# EAGLE design 1013-B-solarwhat-power (EAGLE 7.5.0)

## Sheet 1 of 6
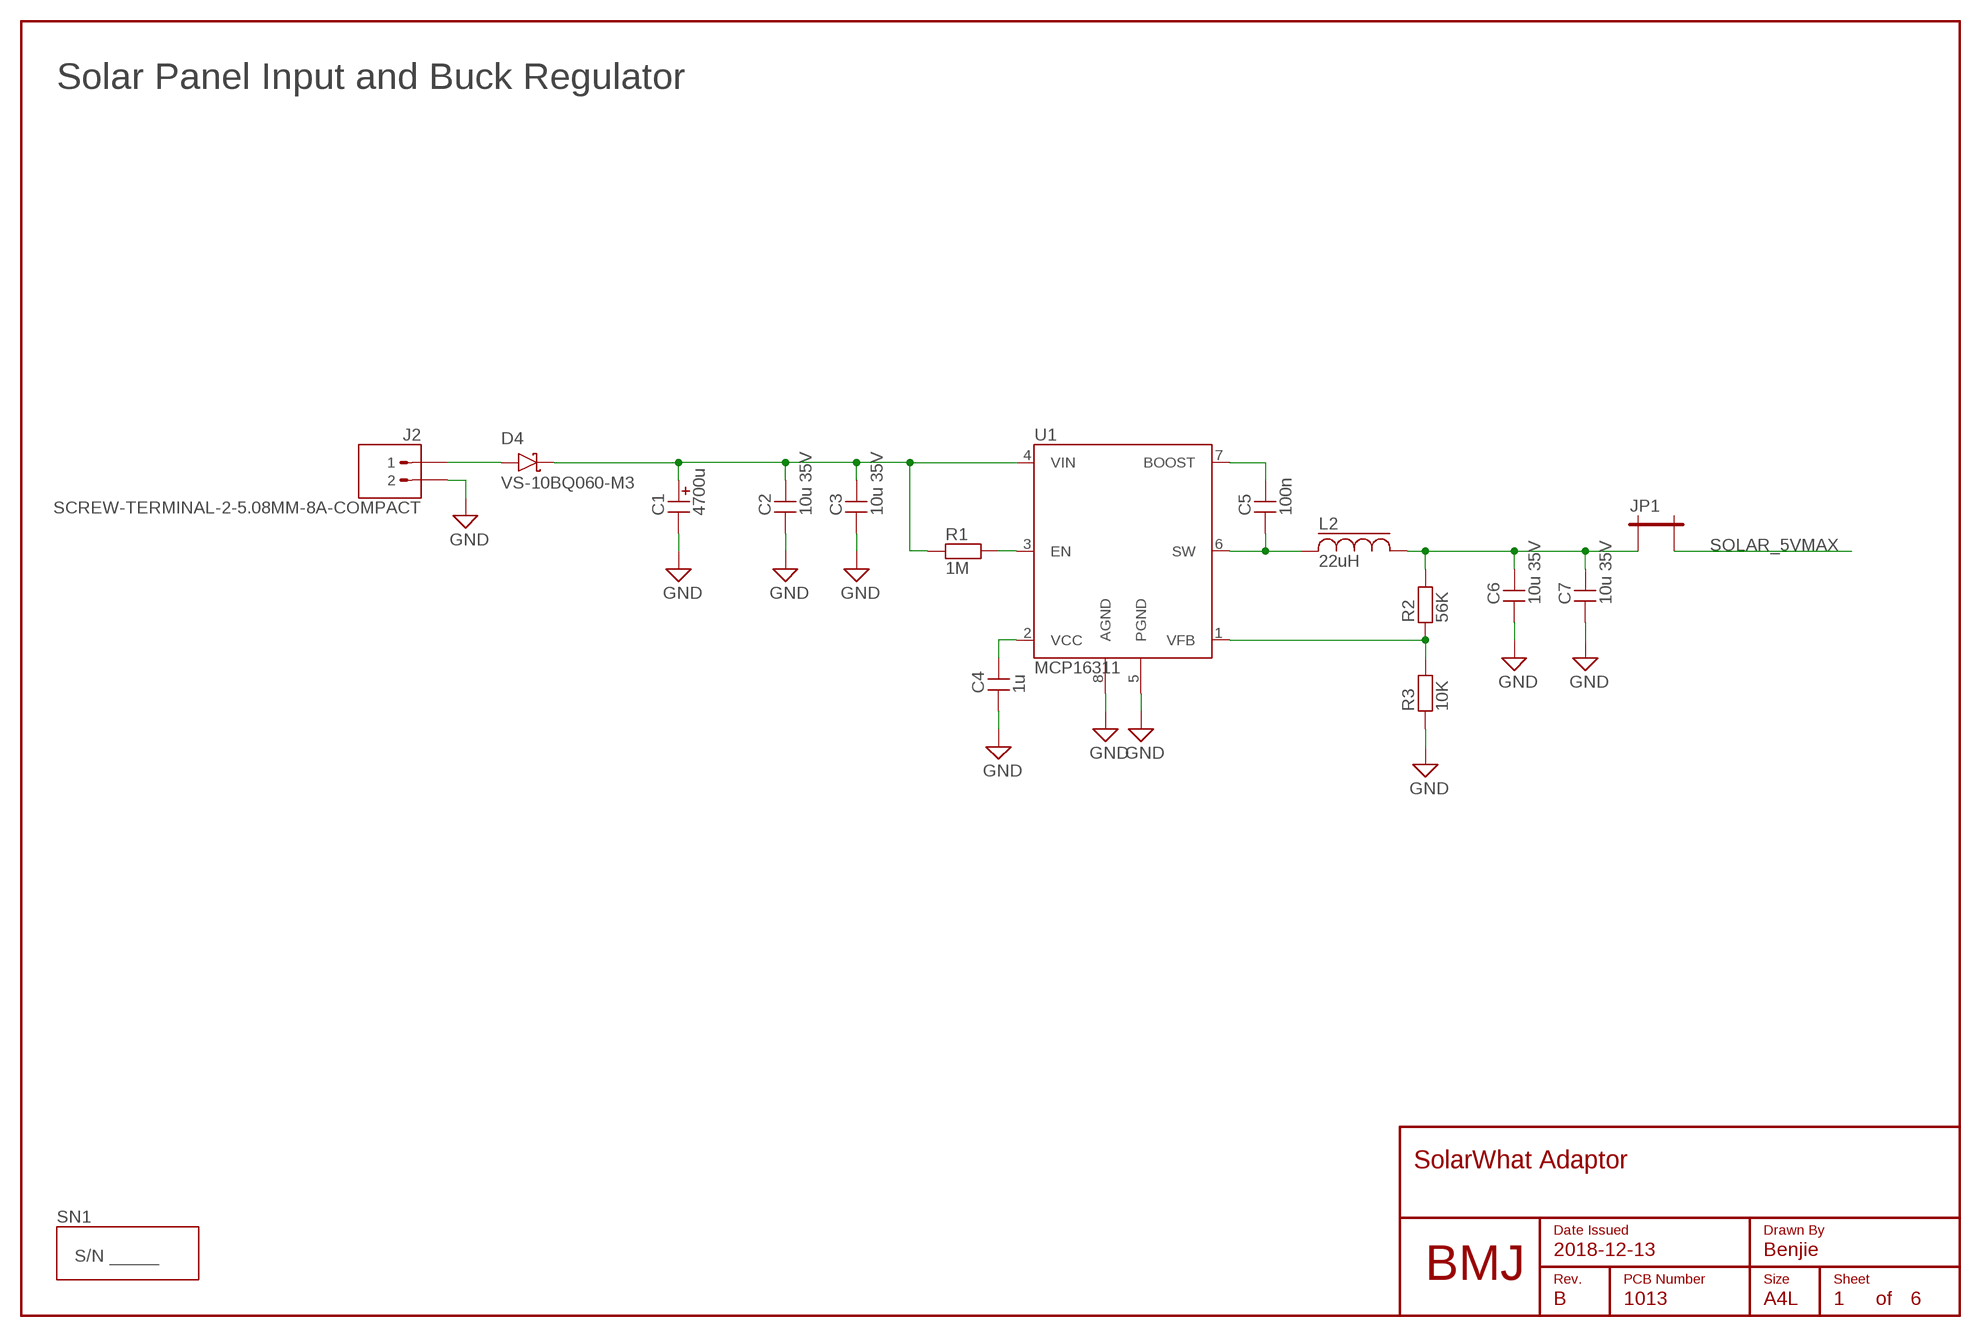
[diagram p0: schematic, sheet 1]

### Parts
C1  4700u  BIG-ELECTROLYTIC  [18X36-TH-FLAT]
C2  10u 35V  1206-10U-35V  [1206]
C3  10u 35V  1206-10U-35V  [1206]
C4  1u  0805-1U  [0805]
C5  100n  0603-100N  [0603]
C6  10u 35V  1206-10U-35V  [1206]
C7  10u 35V  1206-10U-35V  [1206]
D4  VS-10BQ060-M3  [SMB-ST]
FRAME1  A4L-NEW  [PCB-ID]
J2  SCREW-TERMINAL-2-5.08MM-8A-COMPACT  [CTBP0508/2]
JP1  SOLDER-JUMPER-2MM  [SOLDER-JUMPER-2MM]
L2  22uH  TDK-VLSX6045EX-220M  [TDK-VLSX6045EX]
LOGO1  BMJ-LOGO  [BMJ-LOGO]
R1  1M  0603-1%-1M  [0603]
R2  56K  0603-1%-56K  [0603]
R3  10K  0603-1%-10K  [0603]
SN1  SERIAL-NUMBER-AREA  [SERIAL-NUMBER-AREA-SMALL]
U1  MCP16311  [MSOP-8]

### Nets
GND: C1.- C2.1 C3.1 C4.1 C6.1 C7.1 J2.2 R3.1 U1.5(PGND) U1.8(AGND) ; also sheet 2,4,5
N$1: R1.2 U1.3(EN)
N$2: C1.+ C2.2 C3.2 D4.K(C) R1.1 U1.4(VIN)
N$3: C4.2 U1.2(VCC)
N$4: C5.2 U1.7(BOOST)
N$5: C5.1 L2.1 U1.6(SW)
N$6: D4.A J2.1
N$7: R2.1 R3.2 U1.1(VFB)
N$56: C6.2 C7.2 JP1.1 L2.2 R2.2
SOLAR_5VMAX: JP1.2 ; also sheet 2,3

### Notes on the sheet
- Solar Panel Input and Buck Regulator

## Sheet 2 of 6
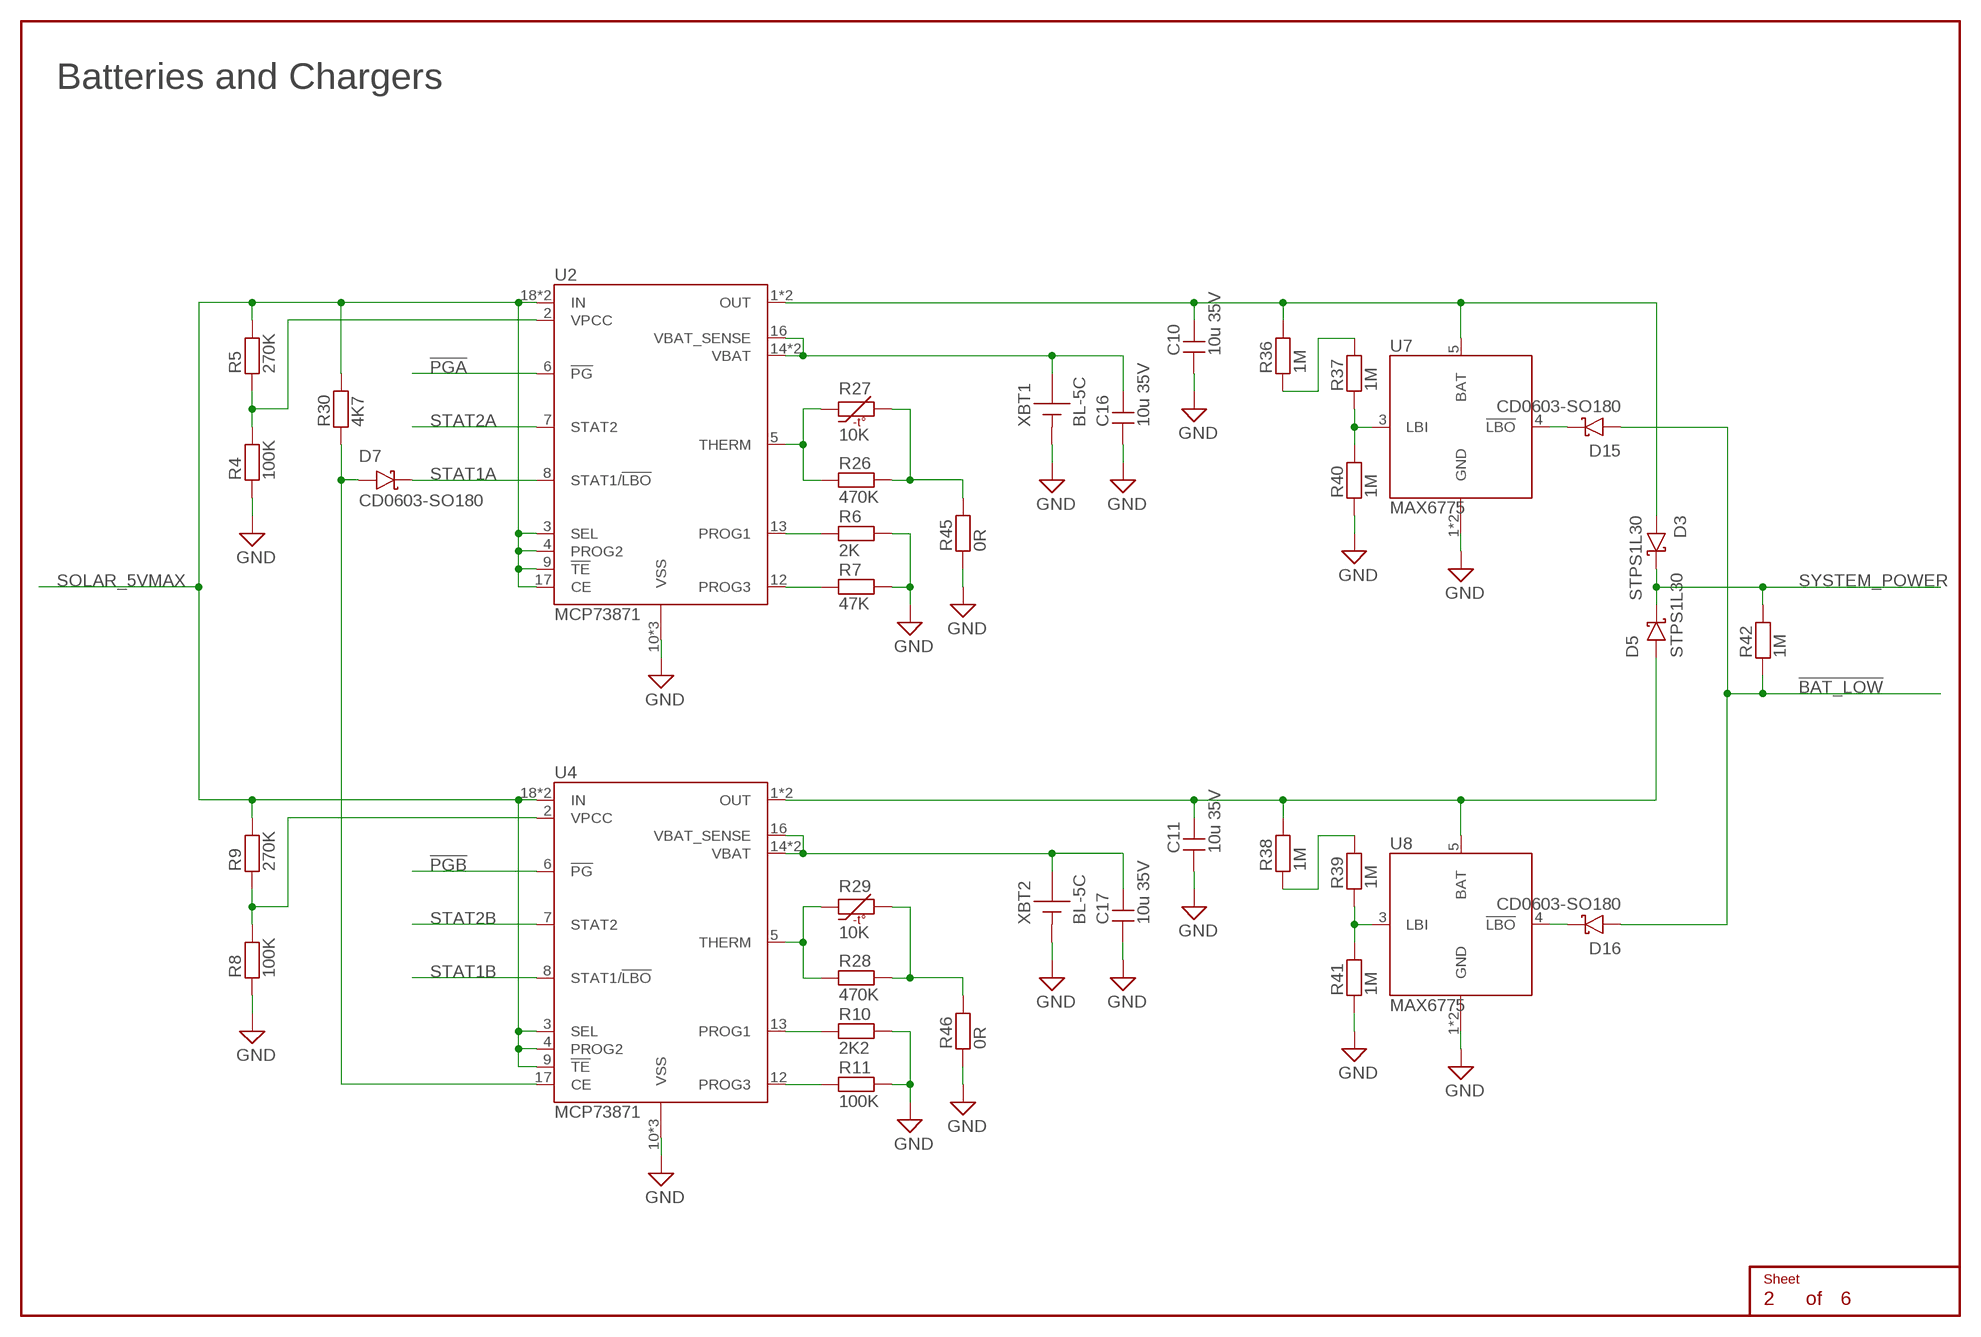
[diagram p1: schematic, sheet 2]

### Parts
C10  10u 35V  1206-10U-35V  [1206]
C11  10u 35V  1206-10U-35V  [1206]
C16  10u 35V  1206-10U-35V  [1206]
C17  10u 35V  1206-10U-35V  [1206]
D3  STPS1L30  [SMB-ST]
D5  STPS1L30  [SMB-ST]
D7  CD0603-SO180  [0603]
D15  CD0603-SO180  [0603]
D16  CD0603-SO180  [0603]
FRAME2  A4L-CONTINUATION  [EMPTY]
R4  100K  0603-1%-100K  [0603]
R5  270K  0603-1%-270K  [0603]
R6  2K  0603-1%-2K  [0603]
R7  47K  0603-1%-47K  [0603]
R8  100K  0603-1%-100K  [0603]
R9  270K  0603-1%-270K  [0603]
R10  2K2  0603-1%-2K2  [0603]
R11  100K  0603-1%-100K  [0603]
R26  470K  0603-1%-470K  [0603]
R27  10K  NTC-0603-10K  [0603]
R28  470K  0603-1%-470K  [0603]
R29  10K  NTC-0603-10K  [0603]
R30  4K7  0603-1%-4K7  [0603]
R36  1M  0603-1%-1M  [0603]
R37  1M  0603-1%-1M  [0603]
R38  1M  0603-1%-1M  [0603]
R39  1M  0603-1%-1M  [0603]
R40  1M  0603-1%-1M  [0603]
R41  1M  0603-1%-1M  [0603]
R42  1M  0603-1%-1M  [0603]
R45  0R  0603-1%-0R  [0603]
R46  0R  0603-1%-0R  [0603]
U2  MCP73871  [QFN-20]
U4  MCP73871  [QFN-20]
U7  MAX6775  [SC70]
U8  MAX6775  [SC70]
XBT1  BL-5C  BL-5CBL5C  [3MM-BATTERY-3WAY]
XBT2  BL-5C  BL-5CBL5C  [3MM-BATTERY-3WAY]

### Nets
!BAT_LOW: D15.A D16.A R42.1 ; also sheet 4,5
!PGA: U2.6(!PG) ; also sheet 3
!PGB: U4.6(!PG) ; also sheet 3
GND: C10.1 C11.1 C16.1 C17.1 R4.1 R6.2 R7.2 R8.1 R10.2 R11.2 R40.1 R41.1 R45.1 R46.1 U2.10(VSS) U2.11(VSS) U2.PAD(VSS) U4.10(VSS) U4.11(VSS) U4.PAD(VSS) U7.1(GND) U7.2(GND) U8.1(GND) U8.2(GND) XBT1.- XBT2.- ; also sheet 1,4,5
N$9: R4.2 R5.1 U2.2(VPCC)
N$10: R6.1 U2.13(PROG1)
N$11: R7.1 U2.12(PROG3)
N$12: C16.2 U2.14(VBAT) U2.15(VBAT) U2.16(VBAT_SENSE) XBT1.+
N$13: C10.2 D3.A R36.2 U2.1(OUT) U2.20(OUT) U7.5(BAT)
N$15: R8.2 R9.1 U4.2(VPCC)
N$16: R10.1 U4.13(PROG1)
N$17: R11.1 U4.12(PROG3)
N$18: C17.2 U4.14(VBAT) U4.15(VBAT) U4.16(VBAT_SENSE) XBT2.+
N$19: C11.2 D5.A R38.2 U4.1(OUT) U4.20(OUT) U8.5(BAT)
N$33: D7.A R30.1 U4.17(CE)
N$37: R26.1 R27.1 U2.5(THERM)
N$39: R28.1 R29.1 U4.5(THERM)
N$46: R36.1 R37.2
N$48: R37.1 R40.2 U7.3(LBI)
N$50: R38.1 R39.2
N$51: R39.1 R41.2 U8.3(LBI)
N$52: D15.K(C) U7.4(!LBO)
N$54: D16.K(C) U8.4(!LBO)
N$55: R26.2 R27.2 R45.2
N$57: R28.2 R29.2 R46.2
SOLAR_5VMAX: R5.2 R9.2 R30.2 U2.3(SEL) U2.4(PROG2) U2.9(!TE) U2.17(CE) U2.18(IN) U2.19(IN) U4.3(SEL) U4.4(PROG2) U4.9(!TE) U4.18(IN) U4.19(IN) ; also sheet 1,3
STAT1A: D7.K(C) U2.8(STAT1/!LBO) ; also sheet 3
STAT1B: U4.8(STAT1/!LBO) ; also sheet 3
STAT2A: U2.7(STAT2) ; also sheet 3
STAT2B: U4.7(STAT2) ; also sheet 3
SYSTEM_POWER: D3.K(C) D5.K(C) R42.2 ; also sheet 4,5

### Notes on the sheet
- Batteries and Chargers

## Sheet 3 of 6
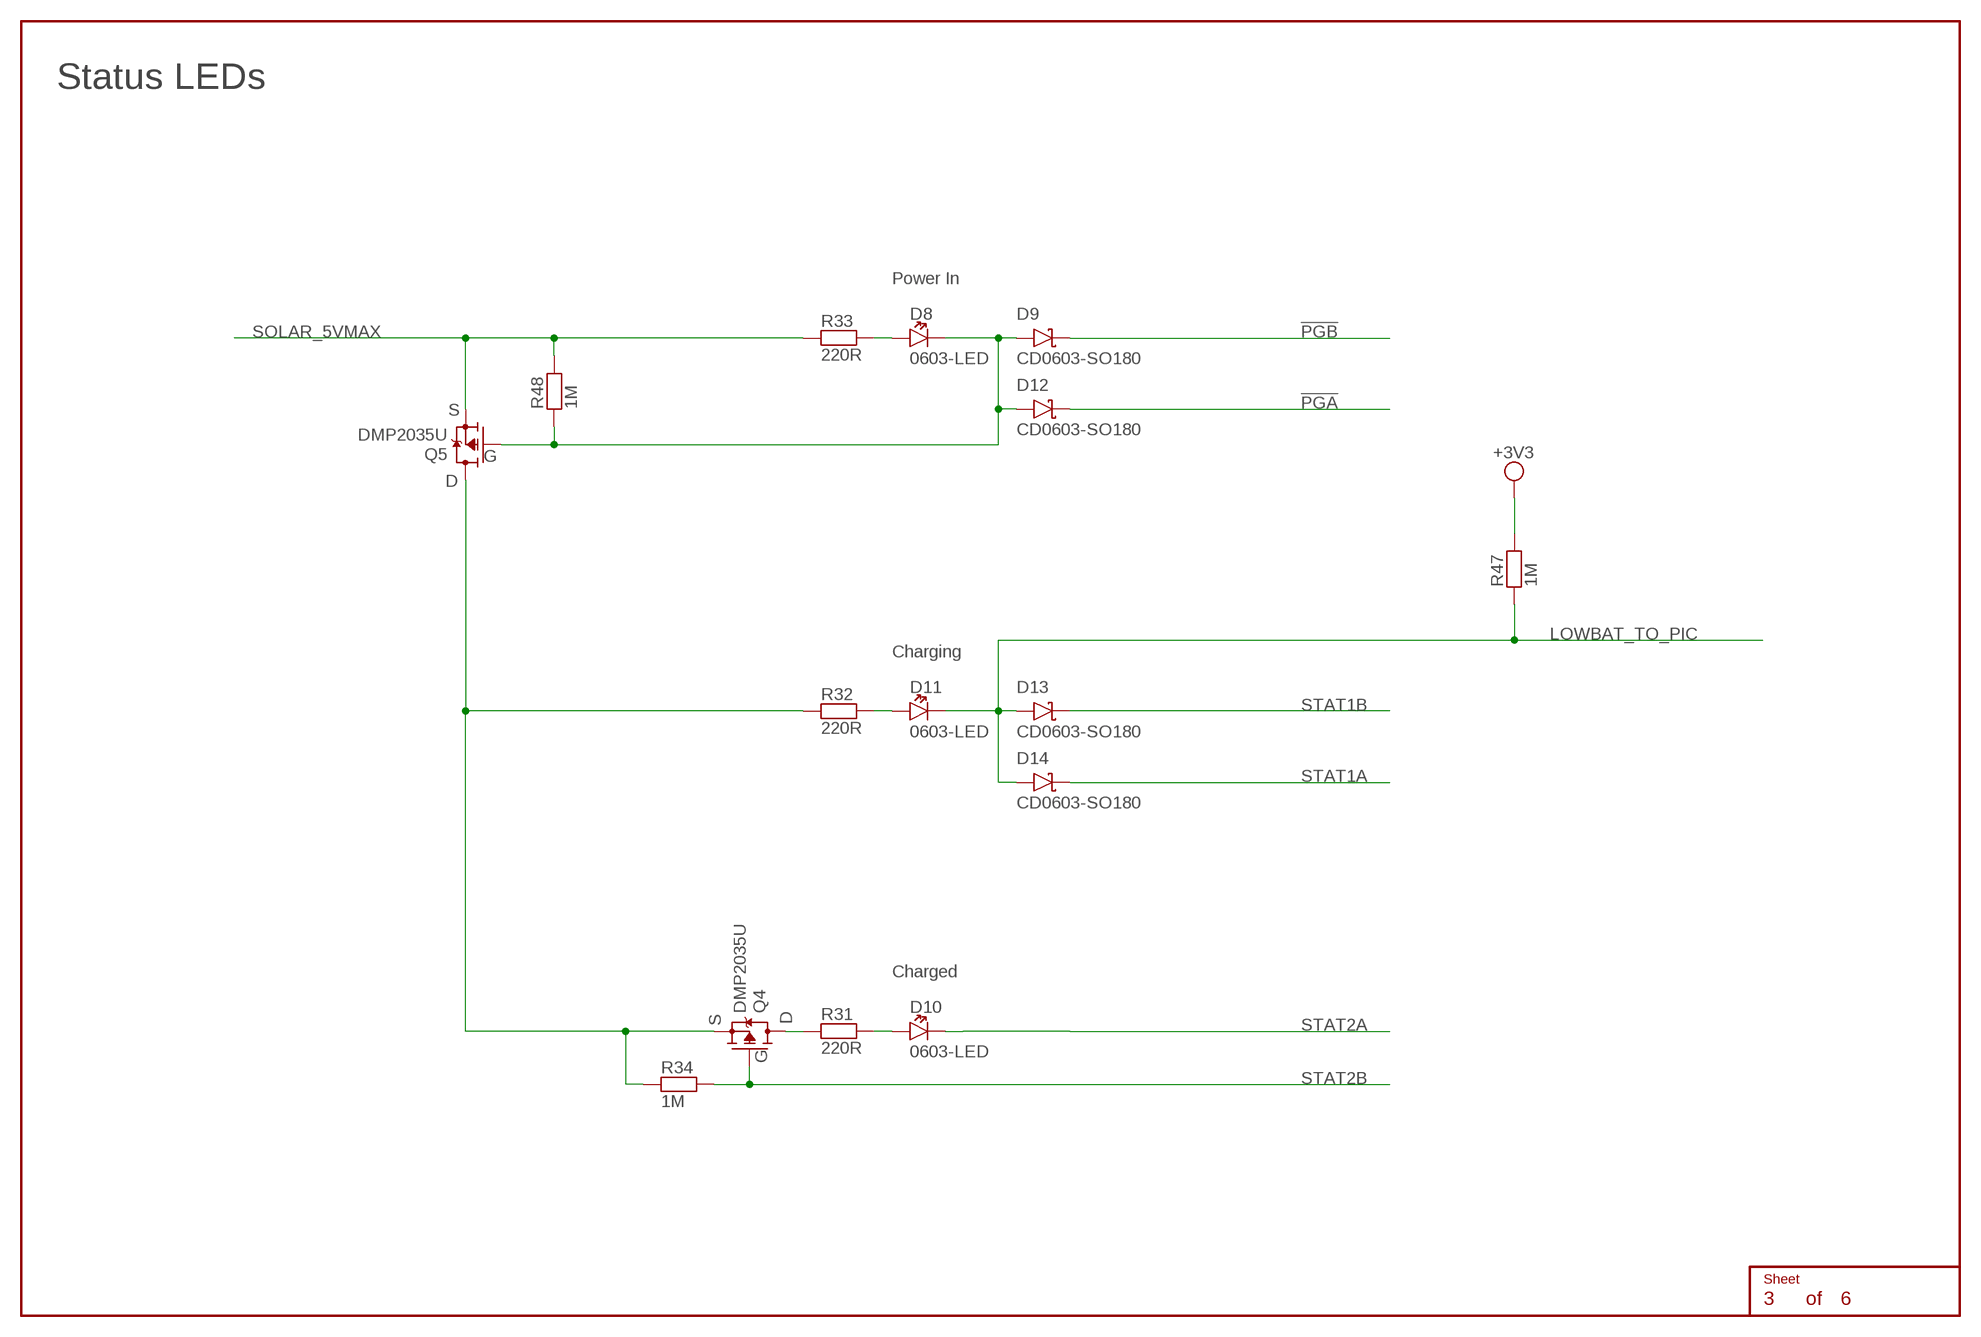
[diagram p2: schematic, sheet 3]

### Parts
D8  0603-LED  [0603-LED]
D9  CD0603-SO180  [0603]
D10  0603-LED  [0603-LED]
D11  0603-LED  [0603-LED]
D12  CD0603-SO180  [0603]
D13  CD0603-SO180  [0603]
D14  CD0603-SO180  [0603]
FRAME5  A4L-CONTINUATION  [EMPTY]
Q4  DMP2035U  [SOT-23]
Q5  DMP2035U  [SOT-23]
R31  220R  0603-1%-220R  [0603]
R32  220R  0603-1%-220R  [0603]
R33  220R  0603-1%-220R  [0603]
R34  1M  0603-1%-1M  [0603]
R47  1M  0603-1%-1M  [0603]
R48  1M  0603-1%-1M  [0603]

### Nets
!PGA: D12.K(C) ; also sheet 2
!PGB: D9.K(C) ; also sheet 2
+3V3: R47.2 ; also sheet 5
GATED-LED-POWER: Q4.2(S) Q5.3(D) R32.1 R34.1
LOWBAT_TO_PIC: D11.C D13.A D14.A R47.1 ; also sheet 5
N$40: D8.C D9.A D12.A Q5.1(G) R48.1
N$41: Q4.3(D) R31.1
N$44: D10.A R31.2
N$47: D11.A R32.2
N$49: D8.A R33.2
SOLAR_5VMAX: Q5.2(S) R33.1 R48.2 ; also sheet 1,2
STAT1A: D14.K(C) ; also sheet 2
STAT1B: D13.K(C) ; also sheet 2
STAT2A: D10.C ; also sheet 2
STAT2B: Q4.1(G) R34.2 ; also sheet 2

### Notes on the sheet
- Status LEDs
- Power In
- Charging
- Charged

## Sheet 4 of 6
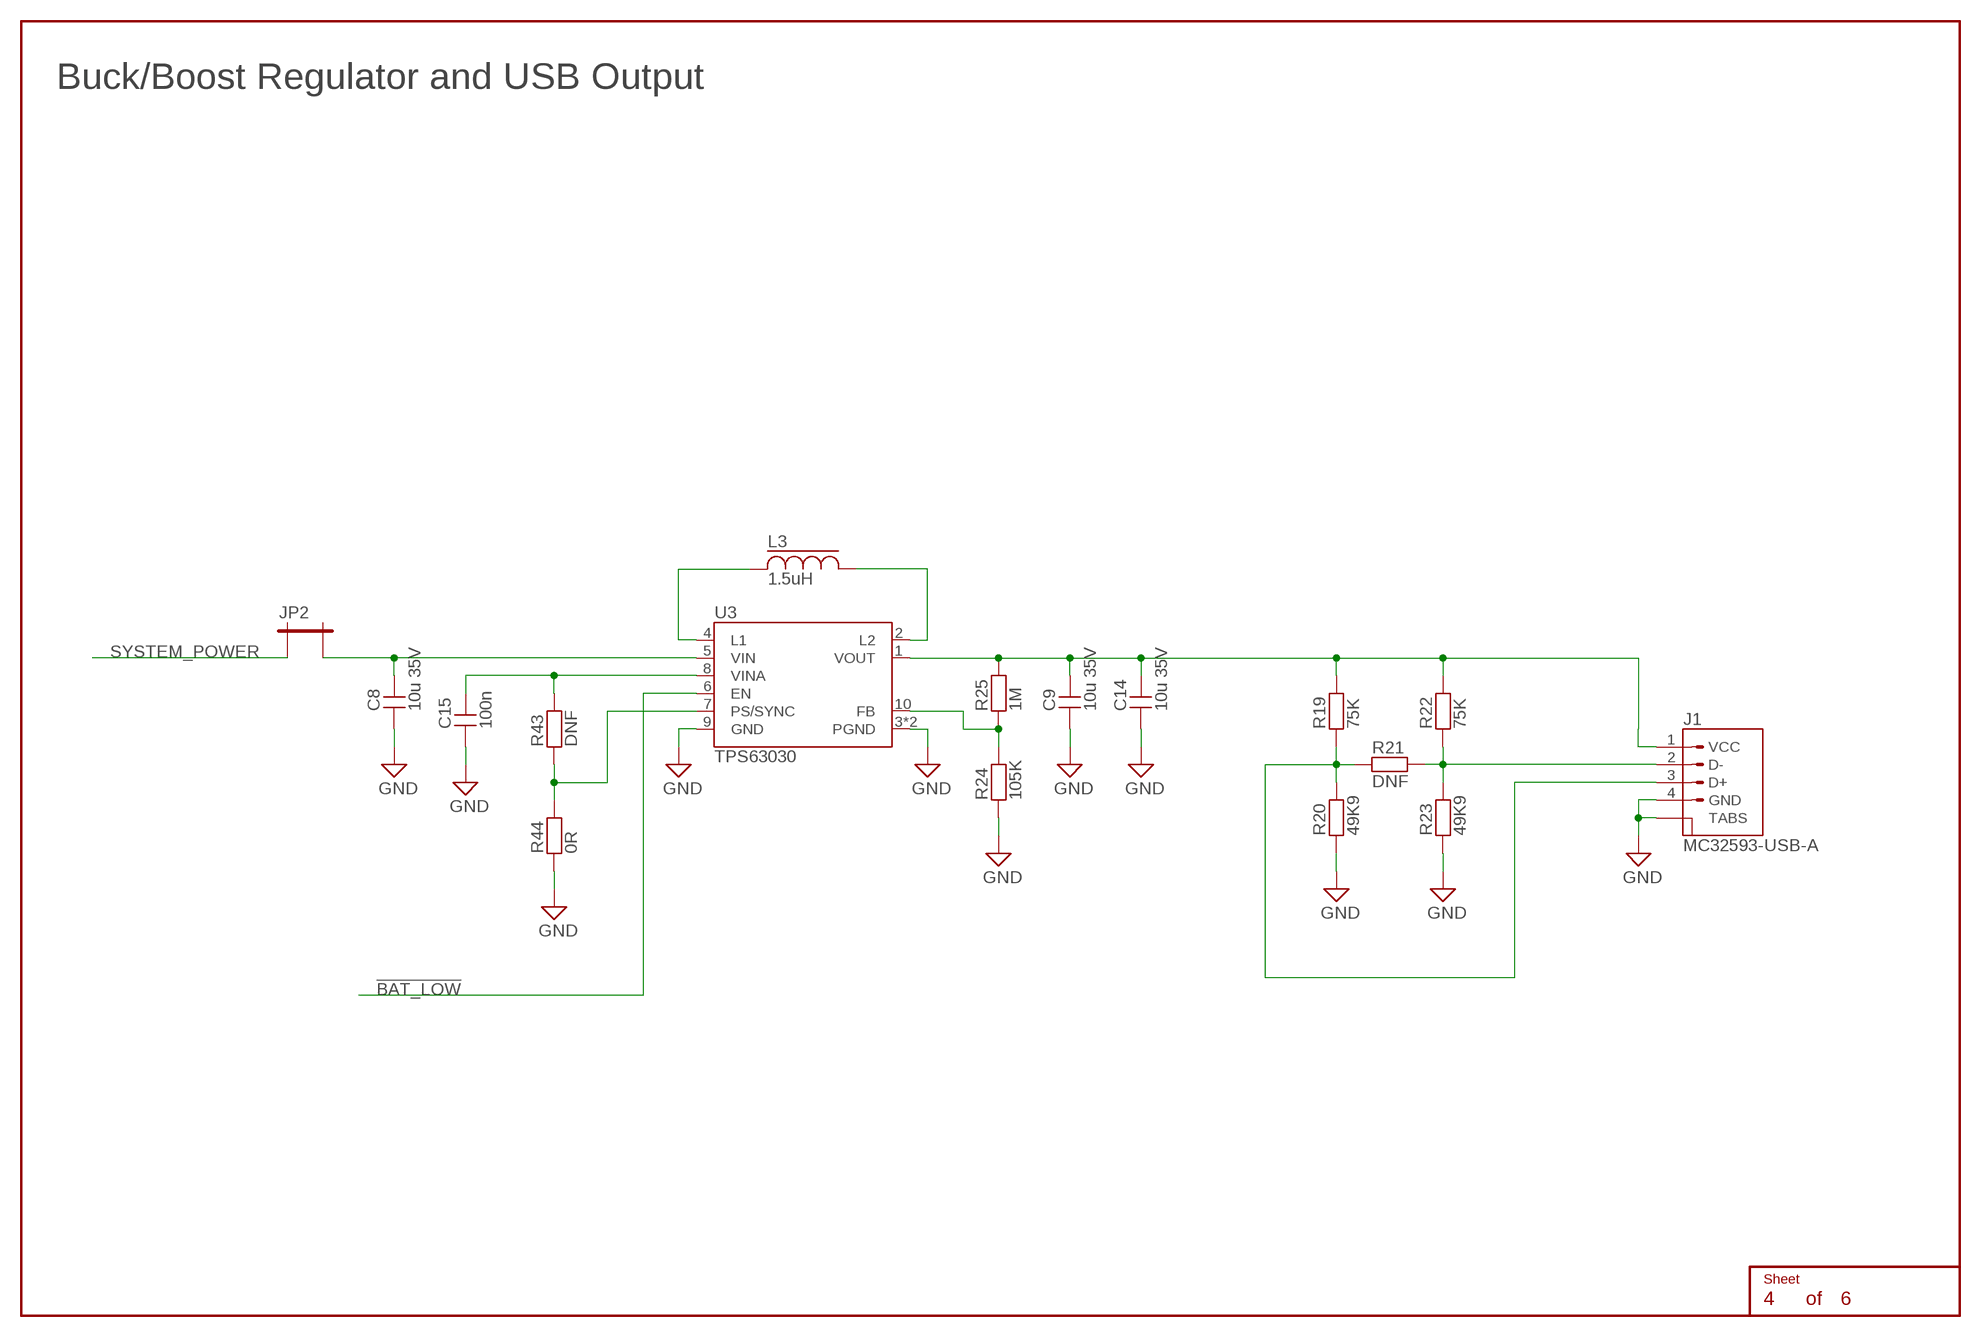
[diagram p3: schematic, sheet 4]

### Parts
C8  10u 35V  1206-10U-35V  [1206]
C9  10u 35V  1206-10U-35V  [1206]
C14  10u 35V  1206-10U-35V  [1206]
C15  100n  0603-100N  [0603]
FRAME3  A4L-CONTINUATION  [EMPTY]
J1  MC32593-USB-A  [MC32593]
JP2  SOLDER-JUMPER-2MM  [SOLDER-JUMPER-2MM]
L3  1.5uH  TDK-VLSX5045EX-1R5N  [TDK-VLSX5045EX]
R19  75K  0603-1%-75K  [0603]
R20  49K9  0603-1%-49K9  [0603]
R21  DNF  CHIP-0603-DNF  [0603]
R22  75K  0603-1%-75K  [0603]
R23  49K9  0603-1%-49K9  [0603]
R24  105K  0603-1%-105K  [0603]
R25  1M  0603-1%-1M  [0603]
R43  DNF  CHIP-0603-DNF  [0603]
R44  0R  0603-1%-0R  [0603]
U3  TPS63030  [VSON-10]

### Nets
!BAT_LOW: U3.6(EN) ; also sheet 2,5
GND: C8.1 C9.1 C14.1 C15.1 J1.4(GND) J1.TAB1(TABS) J1.TAB2(TABS) R20.1 R23.1 R24.1 R44.1 U3.3(PGND) U3.9(GND) U3.PAD(PGND) ; also sheet 1,2,5
N$25: J1.2(D-) R21.2 R22.1 R23.2
N$30: J1.3(D+) R19.1 R20.2 R21.1
N$31: L3.1 U3.4(L1)
N$32: L3.2 U3.2(L2)
N$34: C15.2 R43.2 U3.8(VINA)
N$35: R24.2 R25.1 U3.10(FB)
N$36: C9.2 C14.2 J1.1(VCC) R19.2 R22.2 R25.2 U3.1(VOUT)
N$38: C8.2 JP2.2 U3.5(VIN)
N$53: R43.1 R44.2 U3.7(PS/SYNC)
SYSTEM_POWER: JP2.1 ; also sheet 2,5

### Notes on the sheet
- Buck/Boost Regulator and USB Output

## Sheet 5 of 6
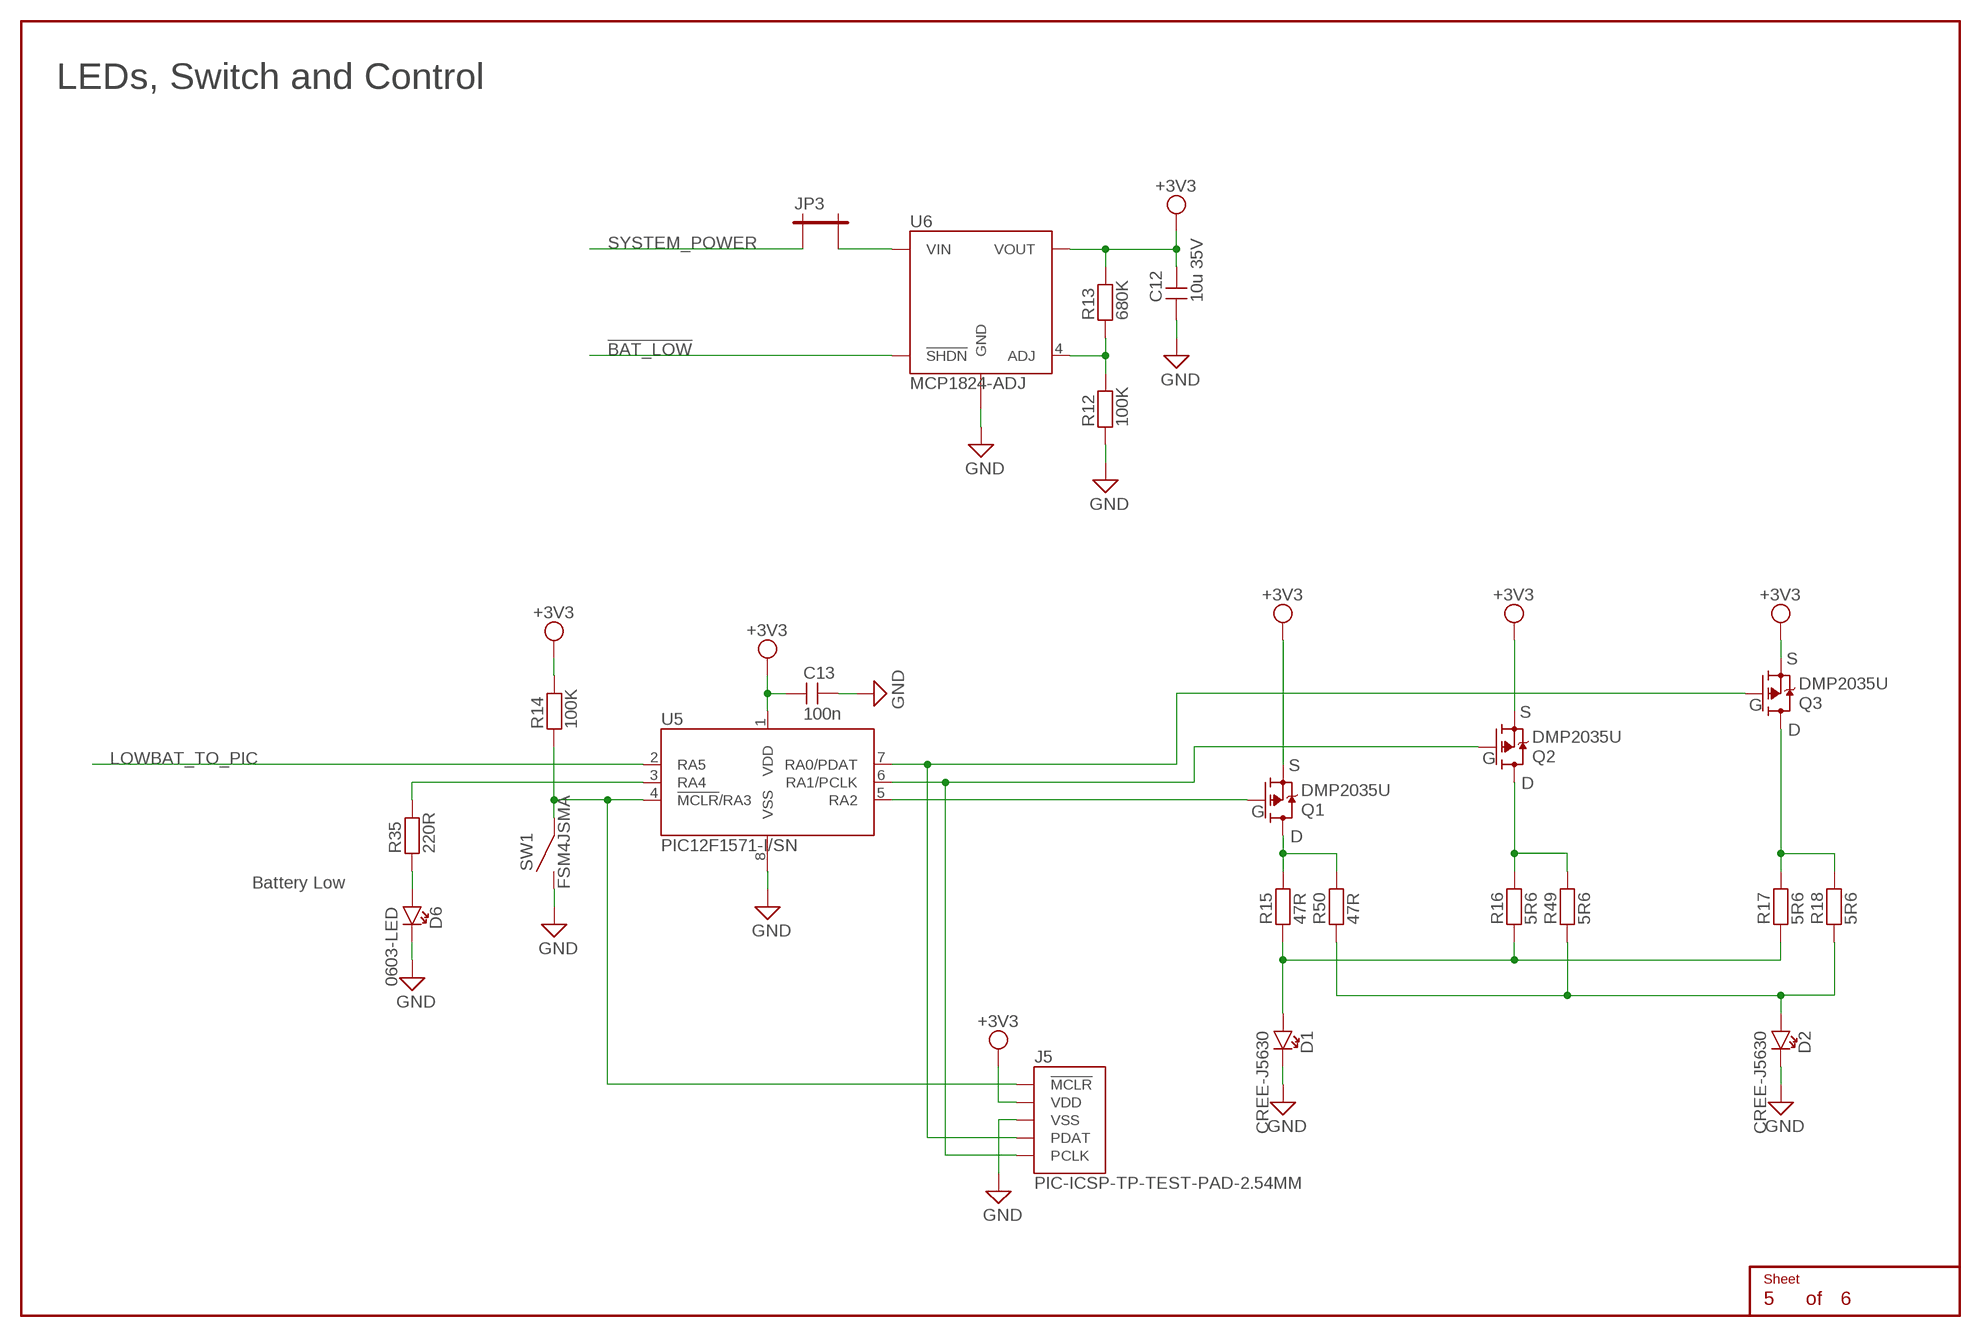
[diagram p4: schematic, sheet 5]

### Parts
C12  10u 35V  1206-10U-35V  [1206]
C13  100n  0603-100N  [0603]
D1  CREE-J5630  [CREE-J5630]
D2  CREE-J5630  [CREE-J5630]
D6  0603-LED  [0603-LED]
FRAME4  A4L-CONTINUATION  [EMPTY]
J5  PIC-ICSP-TP-TEST-PAD-2.54MM  [PIC-ICSP-TEST-PAD-2.54MM]
JP3  SOLDER-JUMPER-2MM  [SOLDER-JUMPER-2MM]
Q1  DMP2035U  [SOT-23]
Q2  DMP2035U  [SOT-23]
Q3  DMP2035U  [SOT-23]
R12  100K  0603-1%-100K  [0603]
R13  680K  0603-1%-680K  [0603]
R14  100K  0603-1%-100K  [0603]
R15  47R  0603-1%-47R  [0603]
R16  5R6  0805  [0805]
R17  5R6  0805  [0805]
R18  5R6  0805  [0805]
R35  220R  0603-1%-220R  [0603]
R49  5R6  0805  [0805]
R50  47R  0603-1%-47R  [0603]
SW1  FSM4JSMA  [ALCOSWITCH-FSM4JSMA]
U5  PIC12F1571-I/SN  [SOIC-8]
U6  MCP1824-ADJ  [SOT-23-5]

### Nets
!BAT_LOW: U6.3(!SHDN) ; also sheet 2,4
+3V3: C12.2 C13.1 J5.V+(VDD) Q1.2(S) Q2.2(S) Q3.2(S) R13.2 R14.2 U5.1(VDD) U6.5(VOUT) ; also sheet 3
GND: C12.1 C13.2 D1.K(C) D2.K(C) D6.C J5.GND(VSS) R12.1 SW1.1@1 SW1.1@2 U5.8(VSS) U6.2(GND) ; also sheet 1,2,4
LOWBAT_TO_PIC: U5.2(RA5) ; also sheet 3
N$8: J5.VPP(!MCLR) R14.1 SW1.2@1 SW1.2@2 U5.4(!MCLR!/RA3)
N$14: R12.2 R13.1 U6.4(ADJ)
N$20: D1.A R15.1 R16.1 R17.1
N$21: Q1.3(D) R15.2 R50.2
N$22: Q2.3(D) R16.2 R49.2
N$23: Q3.3(D) R17.2 R18.2
N$24: D2.A R18.1 R49.1 R50.1
N$26: J5.DAT Q3.1(G) U5.7(RA0/PDAT)
N$27: J5.CLK Q2.1(G) U5.6(RA1/PCLK)
N$28: Q1.1(G) U5.5(RA2)
N$29: R35.2 U5.3(RA4)
N$42: JP3.2 U6.1(VIN)
N$45: D6.A R35.1
SYSTEM_POWER: JP3.1 ; also sheet 2,4

### Notes on the sheet
- LEDs, Switch and Control
- Battery Low

## Sheet 6 of 6
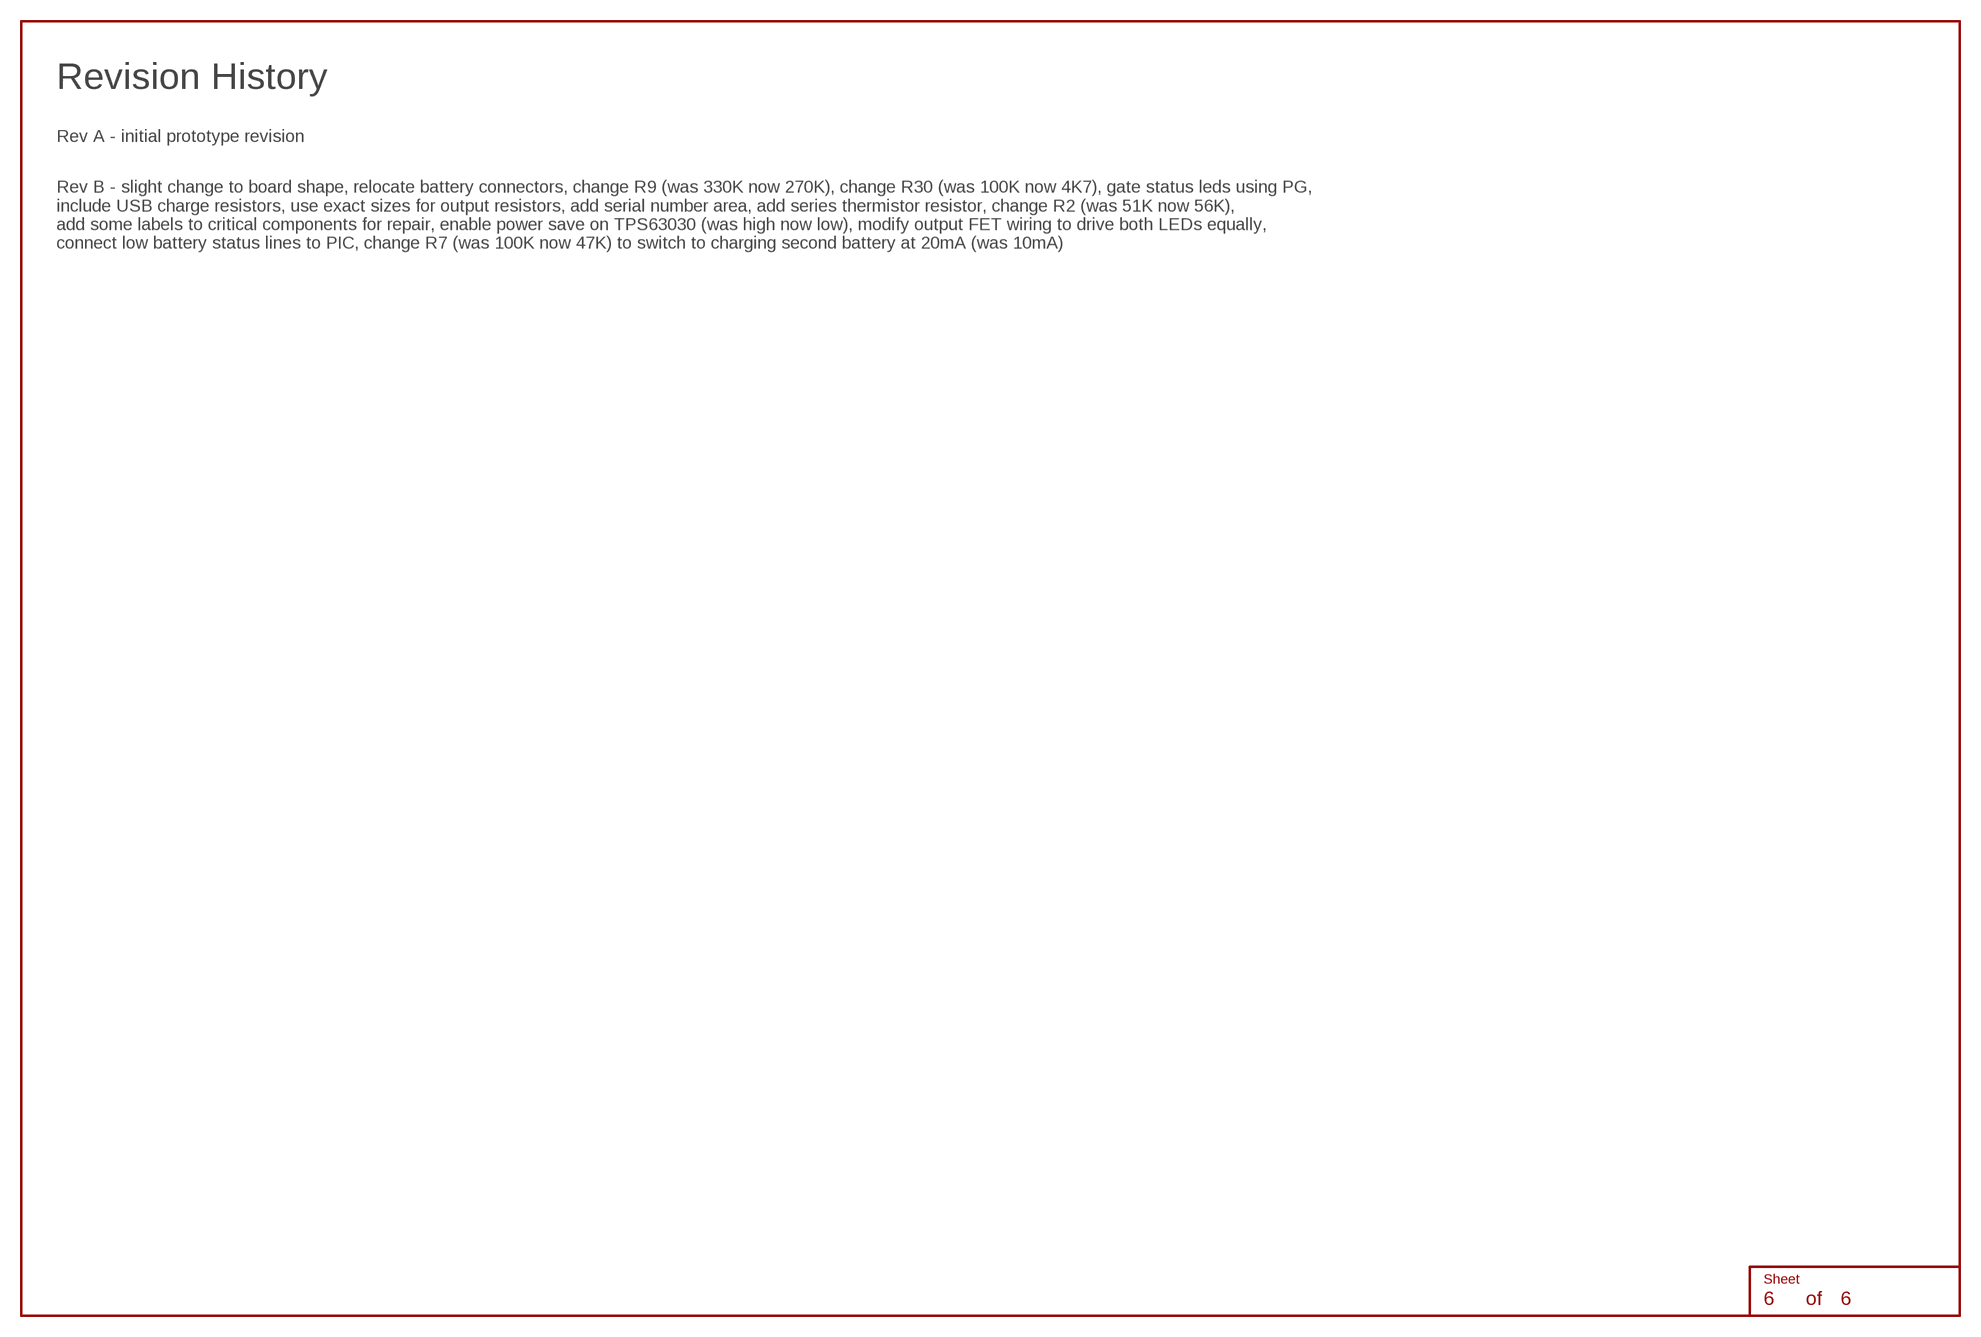
[diagram p5: schematic, sheet 6]

### Parts
FRAME6  A4L-CONTINUATION  [EMPTY]

### Notes on the sheet
- Revision History
- Rev A - initial prototype revision
- Rev B - slight change to board shape, relocate battery connectors, change R9 (was 330K now 270K), change R30 (was 100K now 4K7), gate status leds using PG,
  include USB charge resistors, use exact sizes for output resistors, add serial number area, add series thermistor resistor, change R2 (was 51K now 56K),
  add some labels to critical components for repair, enable power save on TPS63030 (was high now low), modify output FET wiring to drive both LEDs equally,
  connect low battery status lines to PIC, change R7 (was 100K now 47K) to switch to charging second battery at 20mA (was 10mA)

## Library data of the parts
C1 = capacitor-special:BIG-ELECTROLYTIC; MPN: Panasonic ECA1VAM472X; SPN: Farnell 8767327
C2 C3 C6-C12 C14 C16 C17 = capacitor-standard:1206; MPN: 1206 10uF 35V 10% X7R; SPN: standard
C4 = capacitor-standard:0805; MPN: 0805 1uF 50V 10% X7R; SPN: standard
C5 C13 C15 = capacitor-standard:0603; MPN: 0603 100nF 50V 10% X7R; SPN: standard
D1 D2 = led:CREE-J5630
D3 D5 = diode:STPS1L30; MPN: ST STPS1L30U; SPN: Farnell 1467550
D4 = diode:VS-10BQ060-M3; MPN: Vishay VS-10BQ060-M3; SPN: Farnell 2628281
D6 D8 D10 D11 = led:0603-LED; MPN: TruOpto OSR50603C1E; SPN: Rapid 56-3130
D7 D9 D12-D16 = diode:CD0603-SO180; MPN: Bourns CD0603-S0180; SPN: Farnell 1456536
FRAME1 = frame:A4L-NEW; DATEISSUED: 2018-12-13; DRAWNBY: Benjie; PCBNUMBER: 1013; REVISION: B; TITLE: SolarWhat Adaptor
FRAME2-FRAME6 = frame:A4L-CONTINUATION
J1 = connector-usb:MC32593-USB-A; MPN: Multicomp MC32593; SPN: Farnell 1696534
J2 = connector-screw-terminal:SCREW-TERMINAL-2; MPN: CamdenBoss CTBP0508/2; SPN: Farnell 2668641
J5 = ic-microcontroller:PIC-ICSP-TP
JP1-JP3 = pcb-features:SOLDER-JUMPER; BOM: no
L2 = inductor:TDK-VLSX6045EX; MPN: VLS6045EX-220M; SPN: Farnell 2493045
L3 = inductor:TDK-VLSX5045EX; MPN: TDK VLS5045EX-1R5N; SPN: Farnell 2776737
LOGO1 = logo:BMJ-LOGO
Q1-Q5 = transistor:DMP2035U; MPN: Diodes Inc DMP2035U; SPN: Farnell 2061419
R1 R25 R34 R36-R42 R47 R48 = resistor-standard:0603-1%; MPN: 0603 1M 1% 100mW; SPN: standard
R2 R5 R6 R9 R19 R20 R22-R24 = resistor-special:0603-1%
R3 = resistor-standard:0603-1%; MPN: 0603 10K 1% 100mW; SPN: standard
R4 R8 R11 R12 R14 = resistor-standard:0603-1%; MPN: 0603 100K 1% 100mW; SPN: standard
R7 = resistor-standard:0603-1%; MPN: 0603 47K 1% 100mW; SPN: standard
R10 = resistor-standard:0603-1%; MPN: 0603 2.2K 1% 100mW; SPN: standard
R13 = resistor-standard:0603-1%; MPN: 0603 680K 1% 100mW; SPN: standard
R15 R50 = resistor-standard:0603-1%; MPN: 0603 47R 1% 100mW; SPN: standard
R16-R18 R49 = resistor-special:0805
R21 R43 = resistor-dnf:CHIP-; NOTES: Do Not Populate
R26 R28 = resistor-standard:0603-1%; MPN: 0603 470K 1% 100mW; SPN: standard
R27 R29 = thermistor:NTC
R30 = resistor-standard:0603-1%; MPN: 0603 4.7K 1% 100mW; SPN: standard
R31-R33 R35 = resistor-standard:0603-1%; MPN: 0603 220R 1% 100mW; SPN: standard
R44-R46 = resistor-standard:0603-1%; MPN: 0603 0R 1% 100mW; SPN: standard
SN1 = pcb-features:SERIAL-NUMBER-AREA; BOM: no
SW1 = switch-tactile:FSM4JSMA; MPN: Alcoswitch FSM4JSMA; SPN: Farnell 3801305
U1 = ic-power:MCP16311; MPN: Microchip MCP16311T-E/MS; SPN: Farnell 2857601
U2 U4 = ic-power:MCP73871; MPN: MCP73871-2CCI/ML; SPN: Farnell 1642489
U3 = ic-power:TPS63030; MPN: TI TPS63030; SPN: Farnell 2781754
U5 = ic-microcontroller:PIC12F1571; MPN: Microchip PIC12F1571-I/SN; SPN: Farnell 2419682
U6 = ic-power:MCP1824-ADJ
U7 U8 = ic-power:MAX6775
XBT1 XBT2 = battery-connector:BL-5C

## Board
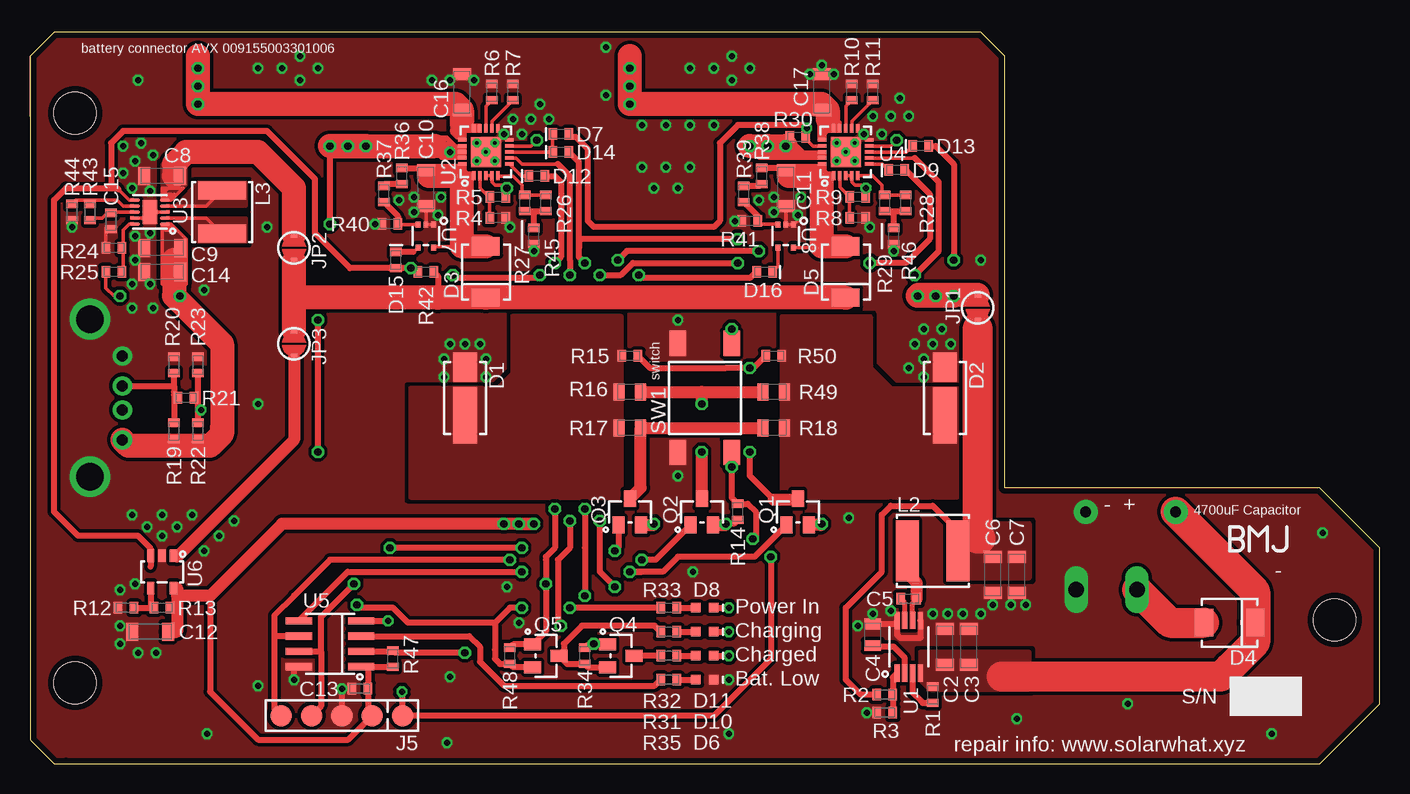
[diagram p6: board, top side]
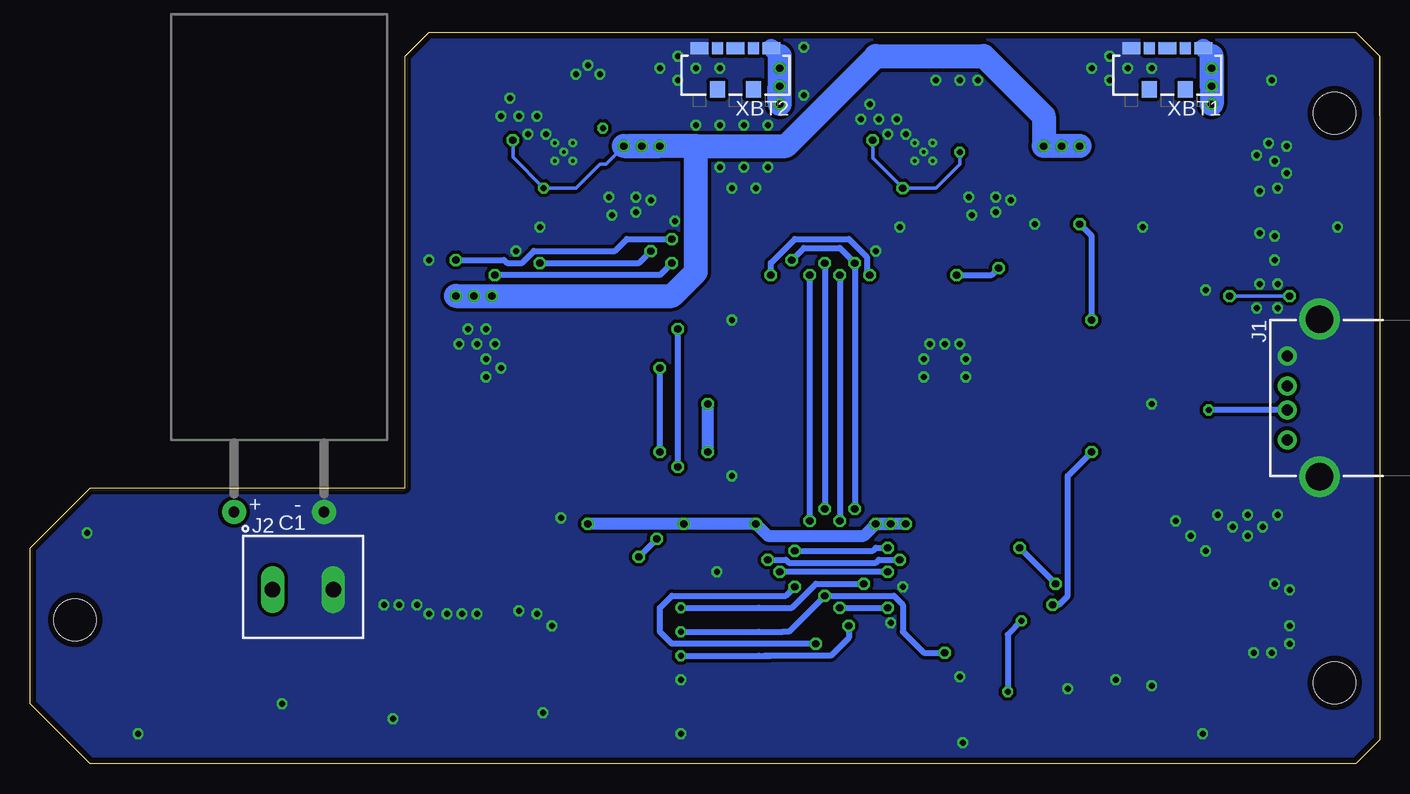
[diagram p7: board, bottom side, seen from below]

Size 112.5 x 61 mm. Coordinates in mm from the lower left corner, seen from the top.
Outline: 0,59 2,61 79.25,61 81.25,59 81.25,23 107.5,23 112.5,18 112.5,5 107.5,0 3,0 2,0 0,2 0,54
Outline: 0,59 0,54
Outline: 0,54 0,59
Outline: 0,59 0,54
Copper layers (1*16): Top 0.035mm / dielectric 1.5mm / Bottom 0.035mm
Design rules "2-layer-pcb-panel *": minimum track width 0.15mm, minimum drill 0.3mm, track to track 0.15mm, track to pad 0.15mm, pad to pad 0.15mm, via to via 0.15mm, smd to smd 0mil, copper to edge 0.5mm, drill to drill 0.5mm, minimum pad ring 10mil, minimum via ring 8mil, stop-mask expansion 4mil, vias tented up to drill 0.6mm, thermal gap 10mil
Holes 3.5 mm at 108.75,12 3.75,6.75 3.75,54.25
tKeepout: area 2.2,50 to 7.8,55.5; area 2.2,2.2 to 7.8,7.8; area 107.2,2.2 to 112.8,7.8; area 2.2,50 to 7.8,55.5; area 2.2,2.2 to 7.8,7.8; area 107.2,2.2 to 112.8,7.8; 16 lines
bKeepout: area 1,1 to 114,56.5

### Footprints (pad centres in the part's own frame; a part is rotated, then mirrored left to right if it is on the bottom)
18X36-TH-FLAT = drill 0.9 pad 2: + 0,3.75; - 0,-3.75
1206 = smd 1 x 1.5: 1 -1.5,0; 2 1.5,0
0805 = smd 0.9 x 1.4: 1 -0.9,0; 2 0.9,0
0603 = smd 0.7 x 0.95: 1 -0.675,0; 2 0.675,0
CREE-J5630 = smd 4.71 x 2: A 1.445,0 | smd 2.47 x 2: K -2.555,0
SMB-ST = smd 1.52 x 2.3: A 2.135,0; K -2.135,0
0603-LED = smd 0.8 x 0.8: A -0.75,0; C 0.75,0
0603' = smd 0.7 x 0.95: A 0.675,0; K -0.675,0
MC32593 = drill 0.92 pad 1.6: 1 3.5,-3; 2 1,-3; 3 -1,-3; 4 -3.5,-3 | drill 2.3 pad 3.4: TAB1 -6.57,-0.3; TAB2 6.57,-0.3
CTBP0508/2 = drill 1.3 long: 1 -2.54,0; 2 2.54,0
PIC-ICSP-TEST-PAD-2.54MM = smd 1.8 x 1.8: CLK 5.08,0; DAT 2.54,0; GND 0,0; V+ -2.54,0; VPP -5.08,0
SOLDER-JUMPER-2MM = smd 0.5 x 0.5: 1 -1.1,0; 2 1.1,0
TDK-VLSX6045EX = smd 1.9 x 5.1: 1 -2.1,0; 2 2.1,0
TDK-VLSX5045EX = smd 1.5 x 4: 1 -1.8,0; 2 1.8,0
SOT-23 = smd 1 x 1.4: 1 -0.95,-1.1; 2 0.95,-1.1; 3 0,1.1
ALCOSWITCH-FSM4JSMA = smd 2.1 x 1.38: 1@1 -4.55,2.24; 1@2 4.55,2.24; 2@1 -4.55,-2.24; 2@2 4.55,-2.24
MSOP-8 = smd 1.45 x 0.45: 1 -2.2,0.975; 2 -2.2,0.325; 3 -2.2,-0.325; 4 -2.2,-0.975; 5 2.2,-0.975; 6 2.2,-0.325; 7 2.2,0.325; 8 2.2,0.975
QFN-20 = smd 0.73 x 0.3: 1 -1.965,1; 2 -1.965,0.5; 3 -1.965,0; 4 -1.965,-0.5; 5 -1.965,-1; 11 1.965,-1; 12 1.965,-0.5; 13 1.965,0; 14 1.965,0.5; 15 1.965,1 | smd 0.3 x 0.73: 6 -1,-1.965; 7 -0.5,-1.965; 8 0,-1.965; 9 0.5,-1.965; 10 1,-1.965; 16 1,1.965; 17 0.5,1.965; 18 0,1.965; 19 -0.5,1.965; 20 -1,1.965 | smd 2.5 x 2.5: PAD 0,0
VSON-10 = smd 0.8 x 0.28: 1 -1.25,1; 2 -1.25,0.5; 3 -1.25,0; 4 -1.25,-0.5; 5 -1.25,-1; 6 1.25,-1; 7 1.25,-0.5; 8 1.25,0; 9 1.25,0.5; 10 1.25,1 | smd 1.2 x 2: PAD 0,0
SOIC-8 = smd 2.2 x 0.6: 1 -2.6,1.905; 2 -2.6,0.635; 3 -2.6,-0.635; 4 -2.6,-1.905; 5 2.6,-1.905; 6 2.6,-0.635; 7 2.6,0.635; 8 2.6,1.905
SOT-23-5 = smd 0.6 x 1.05: 1 -0.95,-1.35; 2 0,-1.35; 3 0.95,-1.35; 4 0.95,1.35; 5 -0.95,1.35
SC70 = smd 0.5 x 0.4: 1 -0.95,0.65; 2 -0.95,0; 3 -0.95,-0.65; 4 0.95,-0.65; 5 0.95,0.65
3MM-BATTERY-3WAY = smd 1.5 x 1: + -3,-3.88; - 3,-3.88; BSI 0,-3.88 | smd 1.25 x 1.35: PAD1 -1.5,-0.42; PAD4 1.5,-0.42 | smd 0.9 x 1: PAD2 -1.5,-3.88; PAD3 1.5,-3.88

### Placement (x,y rotation side)
C1  91.75,21 90 bottom
C2  76.25,9.75 270 top
C3  78.25,9.75 270 top
C4  70.25,10.75 270 top
C5  73.25,13.75 180 top
C6  80.25,15.75 90 top
C7  82.25,15.75 90 top
C8  11,49 0 top
C9  11,43 0 top
C10  33,48 90 top
C11  63,48 90 top
C12  10,11 0 top
C13  27.5,6.25 180 top
C14  11,41 0 top
C15  6.75,45.25 90 top
C16  36,56 270 top
C17  66,56 270 top
D1  36.25,30.5 270 top
D2  76.25,30.5 270 top
D3  38,41 90 top
D4  100,11.75 180 top
D5  68,41 90 top
D6  56.25,7 0 top
D7  CD0603-SO180  [0603']  44.25,52.5 0 top
D8  56.25,13 0 top
D9  CD0603-SO180  [0603']  72.25,49.5 0 top
D10  56.25,9 0 top
D11  56.25,11 0 top
D12  CD0603-SO180  [0603']  42.25,49 0 top
D13  CD0603-SO180  [0603']  74.25,51.5 0 top
D14  CD0603-SO180  [0603']  44.25,51 0 top
D15  CD0603-SO180  [0603']  30.5,42 270 top
D16  CD0603-SO180  [0603']  61.25,41 180 top
FRAME1  99,15.5 0 top
FRAME2  0,0 0 top
FRAME3  0,0 0 top
FRAME4  0,0 0 top
FRAME5  0,0 0 top
FRAME6  0,0 0 top
J1  4.7,30.5 270 bottom
J2  89.75,14.5 0 bottom
J5  26,4 180 top
JP1  79,38 90 top
JP2  22,43 90 top
JP3  22,35 270 top
L2  75.25,17.75 0 top
L3  16,46 270 top
LOGO1  100,17.75 0 top
Q1  64,21 0 top
Q2  56,21 0 top
Q3  50,21 0 top
Q4  49.25,9 270 top
Q5  43,9 270 top
R1  75.25,5.75 270 top
R2  71.25,5.75 180 top
R3  71.25,4.25 0 top
R4  39,45.5 180 top
R5  39,47.25 0 top
R6  38.5,56 90 top
R7  40.25,56 90 top
R8  69,45.5 180 top
R9  69,47.25 0 top
R10  68.5,56 90 top
R11  70.25,56 90 top
R12  8,13 0 top
R13  11,13 0 top
R14  59,21 270 top
R15  50,34 0 top
R16  50,31 0 top
R17  50,28 0 top
R18  62,28 180 top
R19  12,27.75 270 top
R20  12,33.25 270 top
R21  13,30.5 0 top
R22  14,27.75 270 top
R23  14,33.25 270 top
R24  7,43 0 top
R25  7,41 180 top
R26  43,46.75 270 top
R27  41.25,46.75 270 top
R28  73,46.75 270 top
R29  71.25,46.75 270 top
R30  64,52.25 180 top
R31  53.25,9 0 top
R32  53.25,11 0 top
R33  53.25,13 0 top
R34  46.25,9 90 top
R35  53.25,7 180 top
R36  31,49 90 top
R37  29.5,47.5 90 top
R38  61,49 90 top
R39  59.5,47.5 90 top
R40  30,45 0 top
R41  60,45.25 0 top
R42  33,41 0 top
R43  5,46 270 top
R44  3.5,46 90 top
R45  42,44 90 top
R46  72,44 90 top
R47  30.25,8.75 270 top
R48  40,9 270 top
R49  62,31 180 top
R50  62,34 180 top
SN1  96,5 0 top
SW1  56.25,30.5 90 top
U1  73.25,9.75 90 top
U2  38,51 90 top
U3  10,46 180 top
U4  68,51 90 top
U5  25,10 180 top
U6  11,16 180 top
U7  33,44 270 top
U8  63,44 270 top
XBT1  17.7,55.8 180 bottom
XBT2  53.7,55.8 180 bottom

### Tracks (layer width: path | path; a pad name or v marks a point on that pad's centre or on a via)
!BAT_LOW  (via drill 0.6)
  Top 0.3: U3.6 8.25,47 7.38,47.88
  Top 0.5: 10.05,16.45 U6.3 10.05,17.95 9,19 4,19 2,21 2,47 3,48 7,48 | R42.1 32,41.33 v31.75,41.33 | v31.75,41.33 31,41.33 | 31,41.33 D15.A | D15.A 30,41.33 | D15.A 30,41.33 | 7,48 7.25,48 | 30,41.33 26.68,41.33 23.75,44.25 23.75,48.75 19.75,52.75 7.75,52.75 6.75,51.75 6.75,48.25 7,48 | 7.38,47.88 7.25,48 | 7.25,48 7,48 | D16.A 60.5,41 60,40.5 51,40.5 v50.75,40.75 | v42.5,40.75 42.25,40.5 35.5,40.5 v35.25,40.75 | v31.75,41.33 31,41.33
  Bottom 0.5: v50.75,40.75 50.75,41.75 48.75,43.75 44.25,43.75 42.75,42.25 42.75,41 v42.5,40.75 | v35.25,40.75 32.33,40.75 v31.75,41.33
!PGA
  Top 0.3: U2.6 40.97,49 D12.K
!PGB
  Top 0.3: U4.6 71.08,50 D9.K
+3V3  (via drill 0.6)
  Top 0.5: U6.5 12.25,14.65 | R13.2 12.25,13 | U5.1 28.18,8.1 | 28.18,8.1 C13.1 28.18,4.37 J5.V+ 26.54,2 19,2 15,6 15,14 | R14.2 58.67,20 v58,20 | 28.18,8.1 30.23,8.1 R47.2
  Top 1: 12.25,14.65 12.25,14 | 12.25,14 12.25,13 12.25,11 C12.2 | Q3.2 51.9,19.9 v52,20 | v66,20 65.9,19.9 Q1.2 | Q2.2 57.9,19.9 v58,20 | v40.75,20 v42,20 | v42,20 v39.5,20 | v42,20 39,20 25.75,20 21,20 15,14 12.25,14
  Bottom 1: v58,20 v52,20 51,19 43,19 v42,20 | v58,20 60,20 | 60,20 v66,20 | v58,20 60,20 | v42,20 v40.75,20 | v39.5,20 v42,20
GATED-LED-POWER
  Top 0.5: R34.1 46.52,8.05 Q4.2 | 46.17,8.25 R34.1 | R34.1 44.77,8.32 Q5.3 44.1,9.1 44.5,9.5 44.5,10 46,11.5 46.75,11.5 52.08,11.5 R32.1
GND  (via drill 0.3, 0.5)
  Top 0.3: U3.3 U3.PAD 9.5,45.5 U3.9 | 6.33,44.65 R24.1 | U7.1 U7.2 C10.1 | C11.1 U8.2 U8.1 64,45.3 v64,45.75
  Top 0.5: v22,7 22,8 22.3,8 U5.8 | C13.2 v26,6.25 J5.GND | U1.5 74.25,11.93 74.25,10.5 72.5,10.5 72.28,10.72 U1.8 72.28,11.65 C4.1
  other vias: 11,19 9.75,19.75 11,20.75 8.5,20.75 7.5,10 7.5,11.5 9,9.25 8.75,15 7.5,14.5 10.5,9.25 10,47.75 8.5,48 7.75,49.25 8.75,50.25 10.25,50.75 9.25,51.75 7.75,51.5 10,44.25 8.75,44 8.75,42 8.5,40 10,40 10.25,38 8.5,38 19.75,44.75 14.5,39.5 19,30 13.5,20.75 14.5,17.75 15.75,19 14.75,2.5 68.25,20.5 58.25,2.5 19,6.5 36.25,35 35,35 34.5,32.25 38,32.25 38,33.75 34.5,33.75 37.5,35 76.75,35 75.25,35 74.5,36.25 73.75,35 73.25,33 74.5,33.75 74.5,32.25 54,37 54,24 82.25,3.75 76,36.25 3.5,44.75 17,20.25 75.25,12.5 76.5,12.5 77.75,12.5 79.25,12.5 80.25,13.25 81.75,13.25 83,13.25 70.25,12.5 69,11.5 71.75,12.75 69.75,4.25 91.5,5 103.5,2.5 58.25,7 107.75,19.25 67,57.5 62,46 62,47.25 60.75,47 64.25,47.25 34.25,47.25 34,45.75 32,46 32,47.25 30.75,47 33.5,57 24,58 43.25,53.75 37,57 22.5,57 66,58.25 39.5,52.5 40.25,53.75 41.75,53.75 41,52.5 42.5,55 38,51 38.75,50.25 37.25,50.25 37.25,51.75 38.75,51.75 70,44.75 60,58 58.5,59 58.5,57 57,58 69.5,52.5 71,52.5 70.25,54 72.5,55.5 68,51 68.75,51.75 67.25,51.75 67.25,50.25 68.75,50.25 71.75,54 53,53.25 73.25,54 35,7.25 34.75,1.75 42,42.75 40,44.75 53,49.75 12.25,19.75 65,57.5 55,58 21,58 19,58 57,53.25 28.75,45 58.75,45.25 35,57 55,49.75 51,49.75 22.5,59 51,53.25 72,42.75 55,53.25 54,48 52,48 48,55.75 48,59.75 40.75,11.75 39.75,14.75 55.25,16 9,57 79.25,42
  pour Top (isolate 0.3, no thermals): 74.25,10.25 74.25,12.25 76.5,14.5 83.25,14.5 83.25,10.25
  pour Top (isolate 0.3, rank 3, no thermals): 0,0 0,61 81.25,61 81.25,23 112.5,23 112.5,0
  pour Bottom (isolate 0.3, rank 3, no thermals): 0,0 0,61 81.25,61 81.25,23 112.5,23 112.5,0
LOWBAT_TO_PIC  (via drill 0.5, 0.6)
  Top 0.5: D11.C v58.25,11 | 45.75,43 45.75,42.25 v46.25,41.75 | 45.75,43 45.75,43.5 | 45.75,43.5 45.75,50.17 D14.A | v46.25,21.25 46.25,18 v46.25,14 | D13.A 75.5,51.5 77,50 v77,42 | v59,43.75 45.75,43.75 45.75,43.5 | 45.75,43.5 45.75,43 | v36.25,9.25 30.43,9.25 R47.1 30.19,9.37 U5.2
  Bottom 0.5: v58.25,11 51.75,11 49.75,11 49.25,11 v46.25,14 40.5,14 39.75,13.25 39.75,11 38,9.25 v36.25,9.25 | v46.25,41.75 v46.25,21.25 | v77,42 73,42 72.75,41.75 71.5,41.75 70.5,42.75 63.75,42.75 62.75,43.75 v59,43.75
N$1
  Top 0.5: U1.3 73.58,5.92 74.25,5.25 74.42,5.08 R1.2
N$2
  Top 1: D4.K 101.89,12
  Top 2.5: C1.+ 102.14,14.37 D4.K 102.14,10.13 100,8 99.5,7.5 99.25,7.25 81,7.25
  pour Top (isolate 0.3, no thermals): 74.25,9.25 74.25,7 75,6.25 83.25,6.25 83.25,9.25
N$3
  Top 0.5: U1.2 72.92,8.82 72,9.75 70.35,9.75 C4.2
N$4
  Top 0.4: U1.7 72.92,13.4 C5.2
N$5
  Top 0.4: U1.6 73.58,13.4 C5.1
  Top 1: C5.1 73.92,15.07 73.25,15.75 73.25,17.65 L2.1
N$6
  Top 2.5: J2.1 95.04,11.75 D4.A
N$7
  Top 0.5: U1.1 71.92,7.2 R2.1 R3.2
N$8  (via drill 0.5, 0.6)
  Top 0.5: 58.42,35.12 SW1.2@2 v58.5,36.25 | U5.4 v29.84,11.9 29.94,12 | v31,6 31,4.08 J5.VPP 57,4 61.75,8.75 v61.75,17.25 | v60.25,18.75 60.5,19 60.5,21 59.83,21.68 R14.1 58.49,22.18 SW1.2@1 v58.49,24.75 v58.5,24.75
  Bottom 0.5: v29.84,11.9 31,10.75 v31,6 | v60.25,18.75 v61.75,17.25 | v58.5,24.75 v58.5,36.25
N$9
  Top 0.3: U2.2 37.5,48 38.25,47.25 R5.1 R4.2
N$10
  Top 0.3: U2.13 38,54.83 R6.1
N$11
  Top 0.3: U2.12 38.5,53.58 R7.1
N$12  (via drill 0.6)
  Top 0.3: U2.16 36.25,52 36.25,52.75 37.5,52.75 U2.14 | U2.14 U2.15 | 36.25,53.25 36.5,53.25 37.5,53.25 U2.14
  Top 1: 35.75,53.25 35.5,53.25 35.5,52.75 35.75,52.5 35.75,53 35.75,53.5 36,53.75 36.5,53.25
  Top 2: 36,53.5 36,53.75 C16.2 35.5,55 v14,55 14,59
  Bottom 1.5: XBT1.+ 14.68,59.68 14,59
  Bottom 2: 14,59 v14,58 | v14,58 v14,56.5 | v14,56.5 v14,55 | v14,56.5 v14,58 | v14,58 14,59 | v14,58 14,59
N$13
  Top 0.3: U7.5 33.73,43.13 36,43.13 | U2.1 37,49.25 36.25,49.25 36.25,50 U2.20 36.03,49.75 35.25,49.75 35.25,48.75 35.75,48.75 | 36,48.5 36.75,48.5 36.75,49
  Top 0.5: R36.2 33,49.67 C10.2 33,49 33.25,49
  Top 2: D3.A 36,43.13 36,48.5 35.75,48.75 35.5,49 33.25,49
N$14
  Top 0.5: R12.2 R13.1 10.05,13 U6.4
N$15
  Top 0.3: U4.2 67.5,48.08 R9.1 R8.2
N$16
  Top 0.3: U4.13 68,54.83 R10.1
N$17
  Top 0.3: U4.12 68.5,53.58 R11.1
N$18  (via drill 0.6)
  Top 0.3: 66.97,53.5 U4.14 | U4.14 67.5,52.75 66.5,52.75 | 66.5,52.75 66.25,52.5 66.25,52 U4.16 | U4.16 66,52 | 66,52 65.75,52 65.75,53.75 65.75,53 66,52.75 | 66,52.25 66,52.5 66,52.75 | 66,52.75 66.25,53 66.97,53 U4.15 67.22,52.97 67.25,53 67.25,53.25 66.5,53.75 | U4.14 67.5,53.5 67,54 | 66.5,52.75 66.25,52.75 | 66.25,52.75 66,53 | 66,53 66,52.03 U4.16 | 66.25,52.75 arc60 66,52 | 66,52 66,53 | 66.25,52.75 66,53
  Top 0.5: C17.2 66.5,54.5 | 50,59 v50,58
  Top 2: 66.5,53.75 66.5,54.5 66,55 v50,55 v50,58 50,59
  Bottom 1.5: 50,59 50.02,59 XBT2.+
  Bottom 2: 50.02,59 50.02,55.02 | 50.02,55.02 v50,55 | 50.02,55.02 50.02,56.48 v50,56.5
N$19
  Top 0.3: 65.5,49 65.5,49.47 U4.20 66.25,50 66.25,49.25 67,49.25 U4.1 66,49.03 66,49 66,50 | U8.5 65.92,43.05 66,43.13
  Top 0.5: R38.2 62.83,49.67 C11.2 63.25,49.25 63.25,49
  Top 2: D5.A 66,43.13 66,48.5 65.75,48.75 65.5,49 63.25,49
N$20
  pour Top (isolate 0.3, rank 2, no thermals): 39,31.25 31.75,31.25 31.75,22.25 49.25,22.25 49.25,37.25 40.25,37.25 40.25,32.5
N$21  (via drill 0.6)
  Top 0.5: R15.2 51.67,33 58,33 59,33 | R50.2 60.33,33 v60,33 | v60,33 59,33 | 62,22 60,24 v60,26 | v60,33 59,33
  Top 1: Q1.3 63.9,22 62,22
  Bottom 0.5: v60,26 v60,33
N$22  (via drill 0.6)
  Top 1: R16.2 56,31 | 56,31 R49.2 | Q2.3 v56,26 | v56,30 56,31
  Bottom 1: v56,26 v56,30
N$23
  Top 1: R18.2 R17.2 50.9,23 Q3.3
N$24
  pour Top (isolate 0.3, rank 2, no thermals): 62.75,37.25 70,37.25 70,33 71.75,31.25 77.25,31.25 77.25,22.25 62.75,22.25
N$25  (via drill 0.5)
  Top 0.5: R22.1 14,29.75 | 14,29.75 14,30.75 | 14,30.75 R23.2 | R21.2 13.75,30.5 14,30.75 | v14.25,29.5 14,29.75
  Bottom 0.5: J1.2 v14.25,29.5
N$26  (via drill 0.6)
  Top 0.5: U5.7 24.25,9.37 | 24.25,9.37 24.25,12.25 v27,15 | 24.25,9.37 24.25,4.79 J5.DAT | Q3.1 49.05,18.05 v48.75,17.75 | v41,18 v30,18
  Bottom 0.5: v27,15 v30,18 | v48.75,17.75 42.25,17.75 42,18 v41,18
N$27  (via drill 0.6)
  Top 0.5: U5.6 20.36,10.63 20.36,10.5 | 20.36,10.5 20.36,4.55 J5.CLK | Q2.1 52.15,17 v51,17 | v40,17 31,17 27,17 25,17 22,14 20.36,12.37 20.36,10.5
  Bottom 0.5: v51,17 49.5,17 49.25,16.75 42,16.75 41.75,17 v40,17
N$28  (via drill 0.6)
  Top 0.5: Q1.1 60.4,17.25 54,17.25 52.75,16 51,16 | 51,16 v50,16 51,16 | U5.5 26.5,16 v41,16
  Bottom 0.5: v41,16 v50,16
N$29
  Top 0.5: 52.5,6.92 R35.2 52.08,6.5 39.5,6.5 37.5,8.5 37.5,9.75 36.62,10.63 U5.3
N$30
  Top 0.5: 12,31.5 R20.2 | 12,31.5 12,31 | 12,31 12,30.75 | 12,30.75 R19.1 11.93,28.5 | R21.1 12.25,30.5 12,30.75 | J1.3 12,31.5 | 12,31.5 12,31
N$31
  Top 0.3: U3.4 12,46.5 14.7,46.5 L3.1
  pour Top (isolate 0.3, no thermals): 12,46.5 14,48.5 18,48.5 18,46.5
N$32
  Top 0.3: U3.2 14.7,45.5 L3.2
  pour Top (isolate 0.3, no thermals): 12,45.5 14,43.5 18,43.5 18,45.5
N$33  (via drill 0.5)
  Top 0.3: U4.17 65.25,51.5 64.75,52 | 64.75,52 v64.75,53 | R30.1 64.75,52.17 64.75,52
  Top 0.5: v64.75,53 64.5,53.25 59,53.25 57.5,51.75 57.5,45.25 57,44.75 47,44.75 46.5,45.25 46.5,51.25 45.5,52.25 45.17,52.25 D7.A
N$34
  Top 0.3: U3.8 7.67,46 6.75,46 C15.2 6.42,45.92 6,45.5 5,45.5 R43.2
N$35
  Top 0.3: U3.10 8.25,45 8,44.75 7.75,44.5 7.75,43.08 | 7.75,43.08 R24.2 | 7.75,43.08 7.75,41.08 R25.1
N$36  (via drill 0.6)
  Top 0.3: 12,44.75 11.75,45 U3.1 11.25,44.5 11.5,44.5 11.5,44.75 11.75,44.75 11.75,44.5 12,44.5 12,44.75 | 12,44.75 13,43.75 13,43 | 13,43 13,41 | 13,41 13,40 11,40 11,42 | 11,42 11,45 | C9.2 13,43 | C14.2 13,41 | R25.2 6.33,39.67 7,39 v7.5,39 | v12.5,39 12.5,41.5 12,42 11,42
  Top 0.5: R19.2 R22.2 14,26.5
  Top 2: 12,42 12,39 16,35 16,28 16,27.5 15,26.5 14,26.5 8.2,26.5 J1.1
  Bottom 0.3: v7.5,39 v12.5,39
  pour Top (isolate 0.3, no thermals): 11,45 11.75,45 13,43.75 13,40 11,40
N$37
  Top 0.3: R26.1 R27.1 41.25,47.5 41,47.75 41,48.25 40.25,49 39.03,49 U2.5
N$38
  Top 0.3: C8.2 11.25,47.75 U3.5 11,47 11,48 12.75,48 12,47.25 | 12,47.25 11.75,47 11.5,47 11.5,47.5 11.75,47.5 11.75,47.25 12,47.25 | 12,47.25 12,47.5
  Top 0.5: 12,49 C8.2
  Top 2: 12,49 12,50 13,51 19,51 22,48 JP2.2
  pour Top (isolate 0.3, no thermals): 11,47 11.75,47 13,48.25 13,50 11,50
N$39
  Top 0.3: U4.5 70.22,49.03 71,48.25 71,47.67 R29.1 R28.1
N$40  (via drill 0.5, 0.6)
  Top 0.5: D8.C v58.25,13 | D12.A 43.75,49 44.25,48.5 44.25,42.25 v43.75,41.75 | R48.1 40.27,9.95 Q5.1 43,11.05 v43,15 43,17 43,17.25 43.75,18 v43.75,21.25 | D9.A 73,49.5 75,47.5 75,43.75 73,41.75 v70,41.75 | v60.75,42.75 49.75,42.75 v49,42
  Bottom 0.5: v58.25,13 51.75,13 49,13 47,15 v43,15 | v43.75,21.25 v43.75,41.75 45,43 48,43 v49,42 | v70,41.75 61.75,41.75 v60.75,42.75
N$41
  Top 0.5: R31.1 Q4.3
N$42
  Top 0.5: 12.25,17.35 U6.1 12.15,17.35 12.25,17.25
  Top 1: JP3.2 22,27 12.25,17.25
N$44
  Top 0.5: R31.2 D10.A
N$45
  Top 0.5: R35.1 D6.A
N$46
  Top 0.5: R36.1 29.5,48.33 R37.2
N$47
  Top 0.5: R32.2 D11.A
N$48
  Top 0.3: R40.2 30.73,44.95 U7.3
  Top 0.5: R37.1 30.68,45.65 R40.2
N$49
  Top 0.5: R33.2 D8.A
N$50
  Top 0.5: R38.1 60.85,48.17 R39.2
N$51
  Top 0.3: U8.3 62.3,45 61,45 60.75,45.25 R41.2
  Top 0.5: R39.1 60.67,45.65 R41.2
N$52
  Top 0.3: U7.4 31.98,42.67
  Top 0.5: 31.98,42.67 D15.K
N$53
  Top 0.3: U3.7 7.75,46.5 7.25,47 5,47 | R44.2 3.83,47 4,47 5,47 | 5,47 R43.1
N$54
  Top 0.3: U8.4 62.35,41.48 D16.K
N$55
  Top 0.5: R27.2 41.75,46.08 | 41.75,46.08 R26.2 | R45.2 42,45.83 41.75,46.08
N$56
  Top 0.5: R2.2 69.25,5.75 68,7 68,13 71,16 71,20.75 71.75,21.5 75.25,21.5 77,19.75 78.75,19.75 79,20
  Top 2: 79,36.25 JP1.1
  Top 2.5: 79.25,18.75 79,18.75 79,20 79,36.25
  pour Top (isolate 0.3, no thermals): 83.25,15.5 76.75,15.5 76.75,20 83.25,20
N$57
  Top 0.5: R29.2 71.75,46.08 | 71.75,46.08 R28.2 | R46.2 72,45.83 71.75,46.08
SOLAR_5VMAX  (via drill 0.5, 0.6)
  Top 0.3: U2.9 41.75,51.5 v42.25,52 | v39.75,48 39.5,48.25 | 39.5,48.25 38.75,48.25 38.5,48.5 U2.4 U2.3 | R5.2 39.67,48.08 39.5,48.25 | U2.17 U2.18 | U2.18 U2.19 | U2.19 U2.18 | U2.19 36.25,50.5 | 36.25,50.5 36.25,51.5 35.5,51.5 34.75,52.25 | 34.75,52.25 34.08,52.25 | 36.25,50.5 34.25,50.5 34,50.75 36,50.75 35.75,51 v35,51 | v35,51 34.25,51 | 34.25,51 34.12,51.12 | 34.12,51.12 34,51.25 | 33.75,51.5 34,51.5 34.75,52.25 | 34.75,52.25 34.75,52 35.25,51.5 35,51.5 34.75,51.75 34.75,51.5 34.75,51.25 36,51.25 | U4.3 U4.4 68.5,48.5 68.75,48.25 69.25,48.25 69.5,48.25 69.67,48.08 v69.67,48 | v69.67,48 R9.2 v69.67,48 | U4.9 71.75,51.5 v72.25,52 | U4.19 60.75,50.5 60.5,50.75 66,50.75 66.25,50.5 66.25,50.78 U4.18 64.5,51 | 64.5,51 64,51.5 v63,51.5 63,51.92 R30.2 | 64.5,51 64.25,51 | 64.25,51 63.5,51 63.75,51 64,51.25 64.25,51 | v35,51 34.25,51 | 34.25,51 34.12,51.12
  Top 0.5: Q5.2 40.27,8.05 R48.2 39.17,8.32 38.75,8.75 38.75,9.5 38.75,11.75 | R33.1 v45,13 | v41,13 40,13 38.75,11.75 | 74.1,39.1 75.4,39.1 v75.5,39 | 38.75,11.75 31.5,11.75 30.25,13 27.5,13 v27.25,13.25 | v24,26 v24,37 | v25,45 v25,51.5
  Top 1.5: 34,51.25 33.75,51.5
  Top 2: v60,51.5 v61.5,51.5 v63,51.5 | v28,51.5 v26.5,51.5 | v26.5,51.5 26,51.5 | 26,51.5 v25,51.5 26,51.5 | 26,51.5 v26.5,51.5 | v26.5,51.5 33.75,51.5 | v77,39 v75.5,39 v74,39 74.1,39.1 JP1.2
  Bottom 0.3: v42.25,52 42.25,50.5 v39.75,48 37,48 36,49 35,50 v35,51 | v72.25,52 72.25,50.58 v69.67,48 67,48 65,50 64.5,50 v63,51.5
  Bottom 0.5: v45,13 v41,13 | v27.25,13.25 26.75,13.25 26,14 26,24 v24,26 | v24,37 24,41 24,44 v25,45
  Bottom 2: v60,51.5 58.85,51.5 57,51.5 | v63,51.5 62.5,51.5 | 62.5,51.5 v61.5,51.5 | v61.5,51.5 v60,51.5 | v60,51.5 v61.5,51.5 | v61.5,51.5 62.5,51.5 | v25,51.5 v26.5,51.5 v28,51.5 28,54 33,59 42,59 49.5,51.5 57,51.5 | v77,39 59,39 57,41 57,51.5
STAT1A
  Top 0.3: U2.8 D14.K D7.K
STAT1B
  Top 0.3: U4.8 73.08,51 D13.K
STAT2A  (via drill 0.5, 0.6)
  Top 0.3: U2.7 40.5,50.5 41,50 44,50
  Top 0.5: D10.C v58.25,9 | 44,50 45,49 45,42 v45,40.75 | v45,20.25 45,18 44,17 44,11.75 v44.25,11.5
  Bottom 0.5: v58.25,9 51.75,9 51.25,9 | 51.25,9 50.75,9 | v45,40.75 v45,20.25 | v44.25,11.5 44.25,10.5 45.75,9 51.25,9
STAT2B  (via drill 0.6)
  Top 0.3: U4.7 73.75,50.5
  Top 0.5: R34.2 46.52,9.95 Q4.1 48.1,10 v47,10 | v48.75,14.75 47.5,16 v47.5,20.25 | v47.5,40.75 49.25,40.75 50.25,41.75 v59,41.75 | v73.75,40.75 75.75,42.75 75.75,48.5 73.75,50.5
  Bottom 0.5: v47,10 59,10 60,11 60,13 59,14 49.5,14 v48.75,14.75 | v47.5,20.25 v47.5,40.75 | v59,41.75 60,40.75 69.25,40.75 v73.75,40.75
SYSTEM_POWER
  Top 0.5: R42.2 34,40.67 34,38.87 D3.K
  Top 2: D5.K D3.K 34,38.87 22,38.87 | 22,38.87 JP2.1 | JP3.1 22,38.87

### Text on the board
tPlace: battery connector AVX 009155003301006 | switch | - + | 4700uF Capacitor | Power In | Charging | Charged | Bat. Low | repair info: www.solarwhat.xyz